# Altium project MAIN_BOARD.PrjPcb (part 2 of 3)

## Sheet USB.SchDoc
size D; SheetNumber: 4; SheetTotal: 8
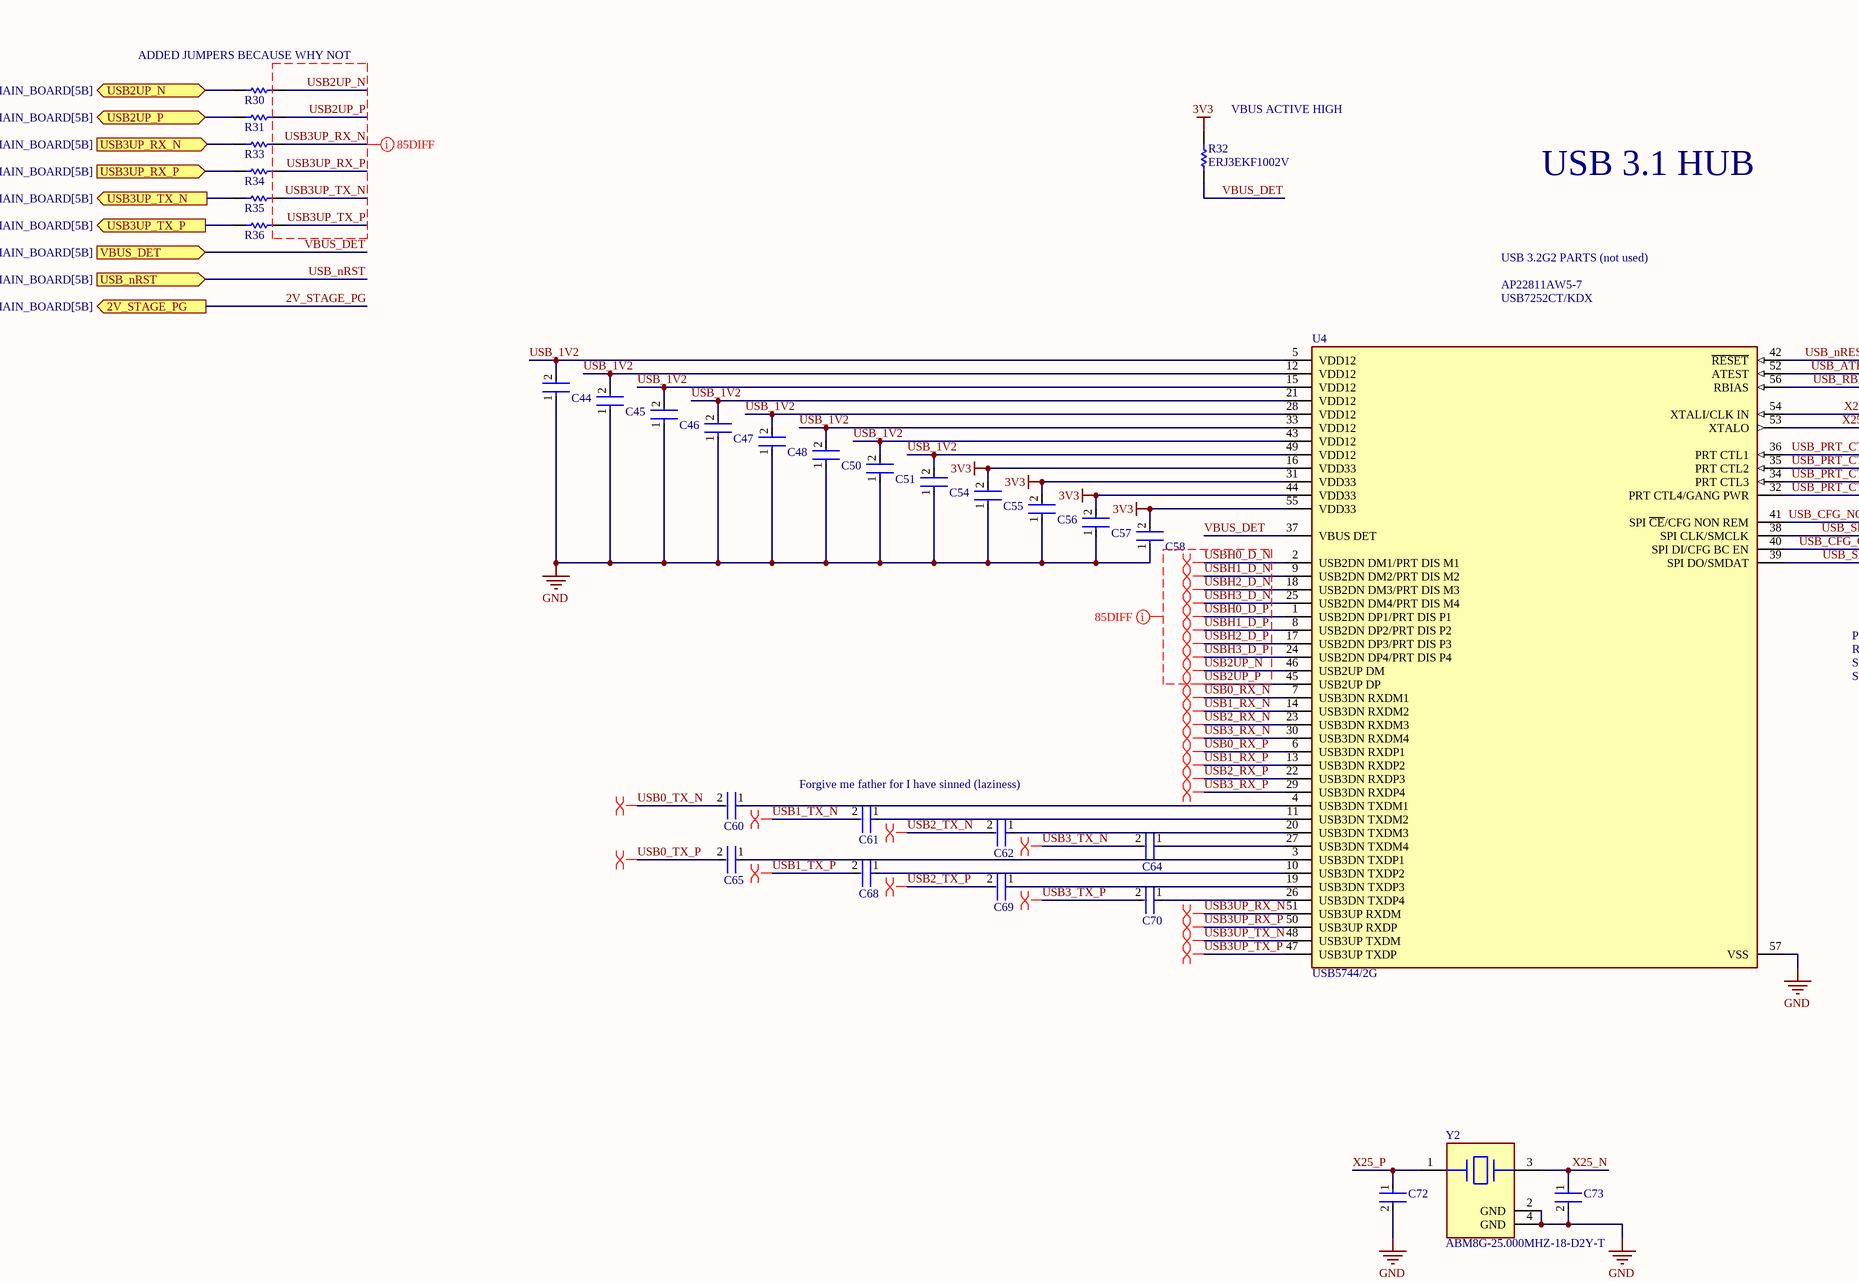
[diagram p10: USB.SchDoc, top left]
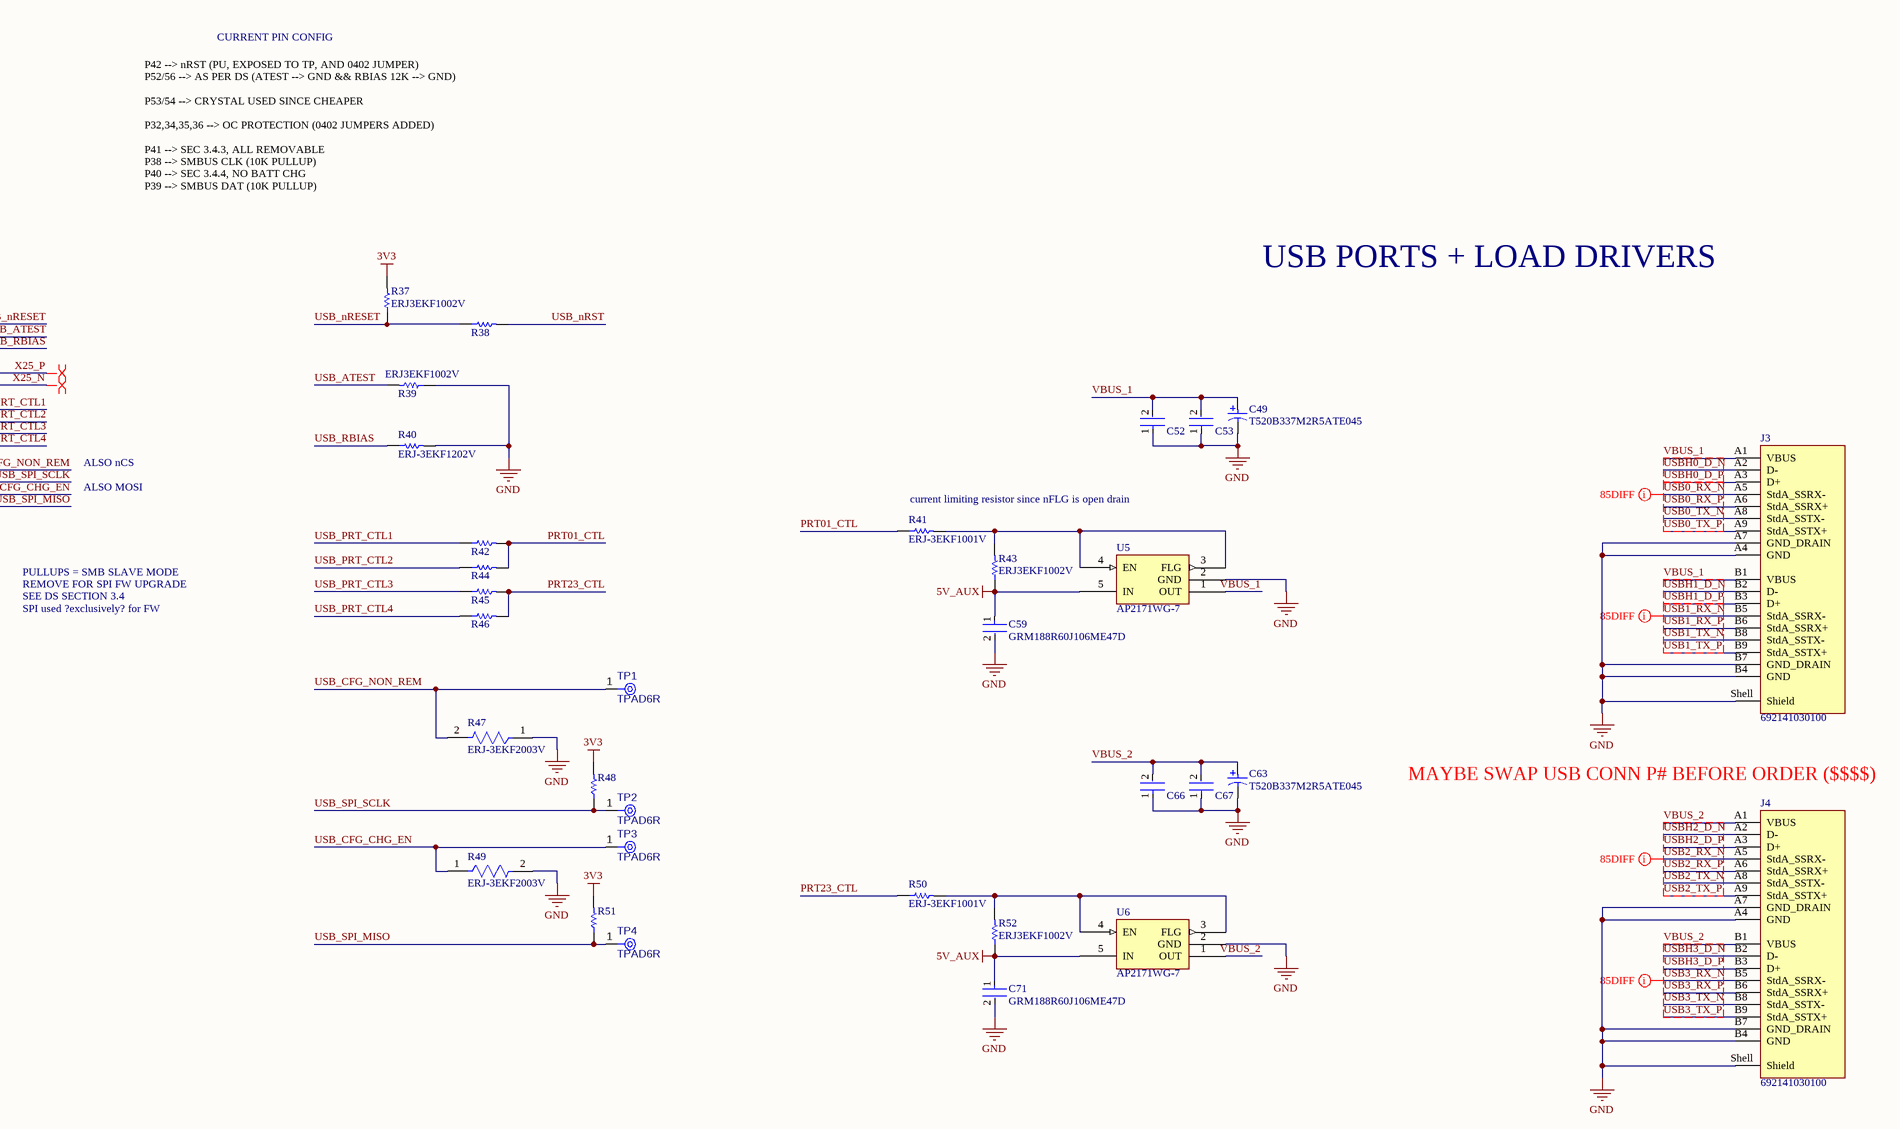
[diagram p11: USB.SchDoc, top right]
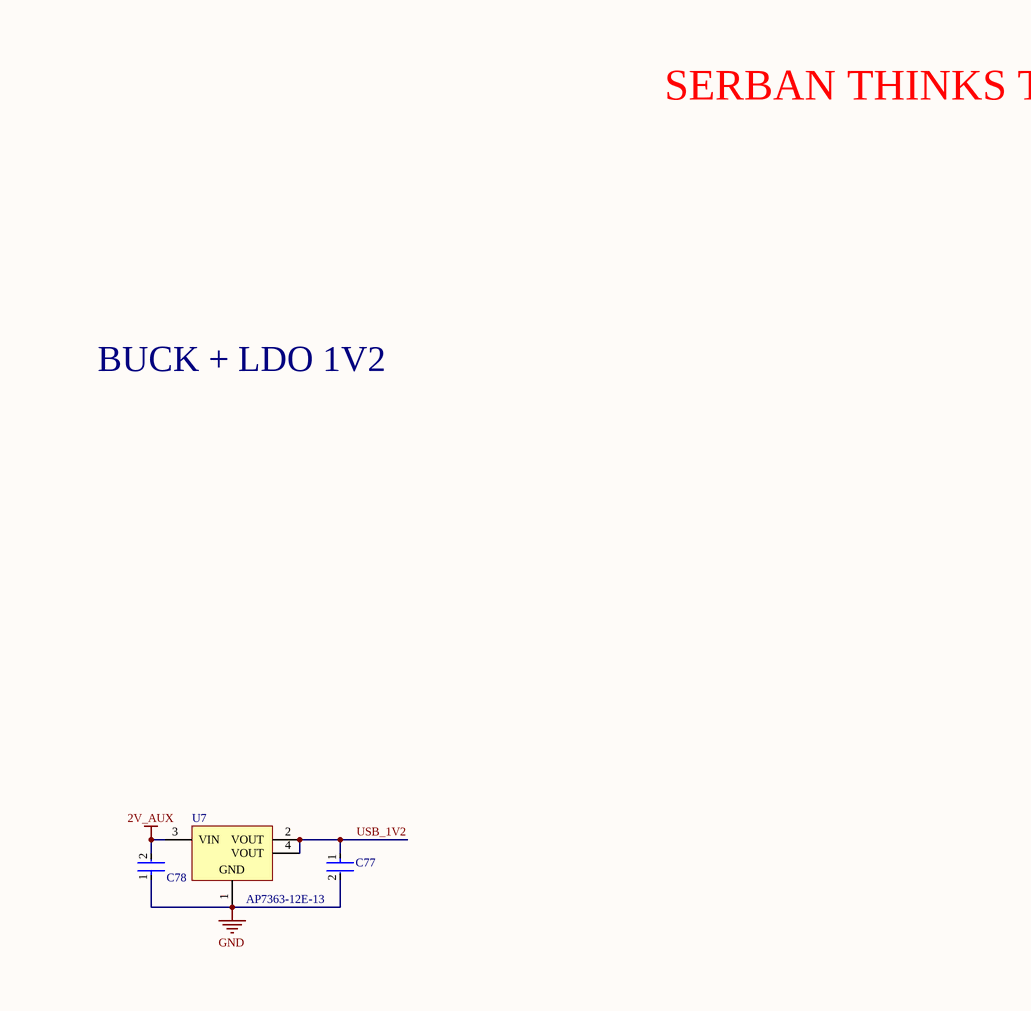
[diagram p12: USB.SchDoc, bottom left]
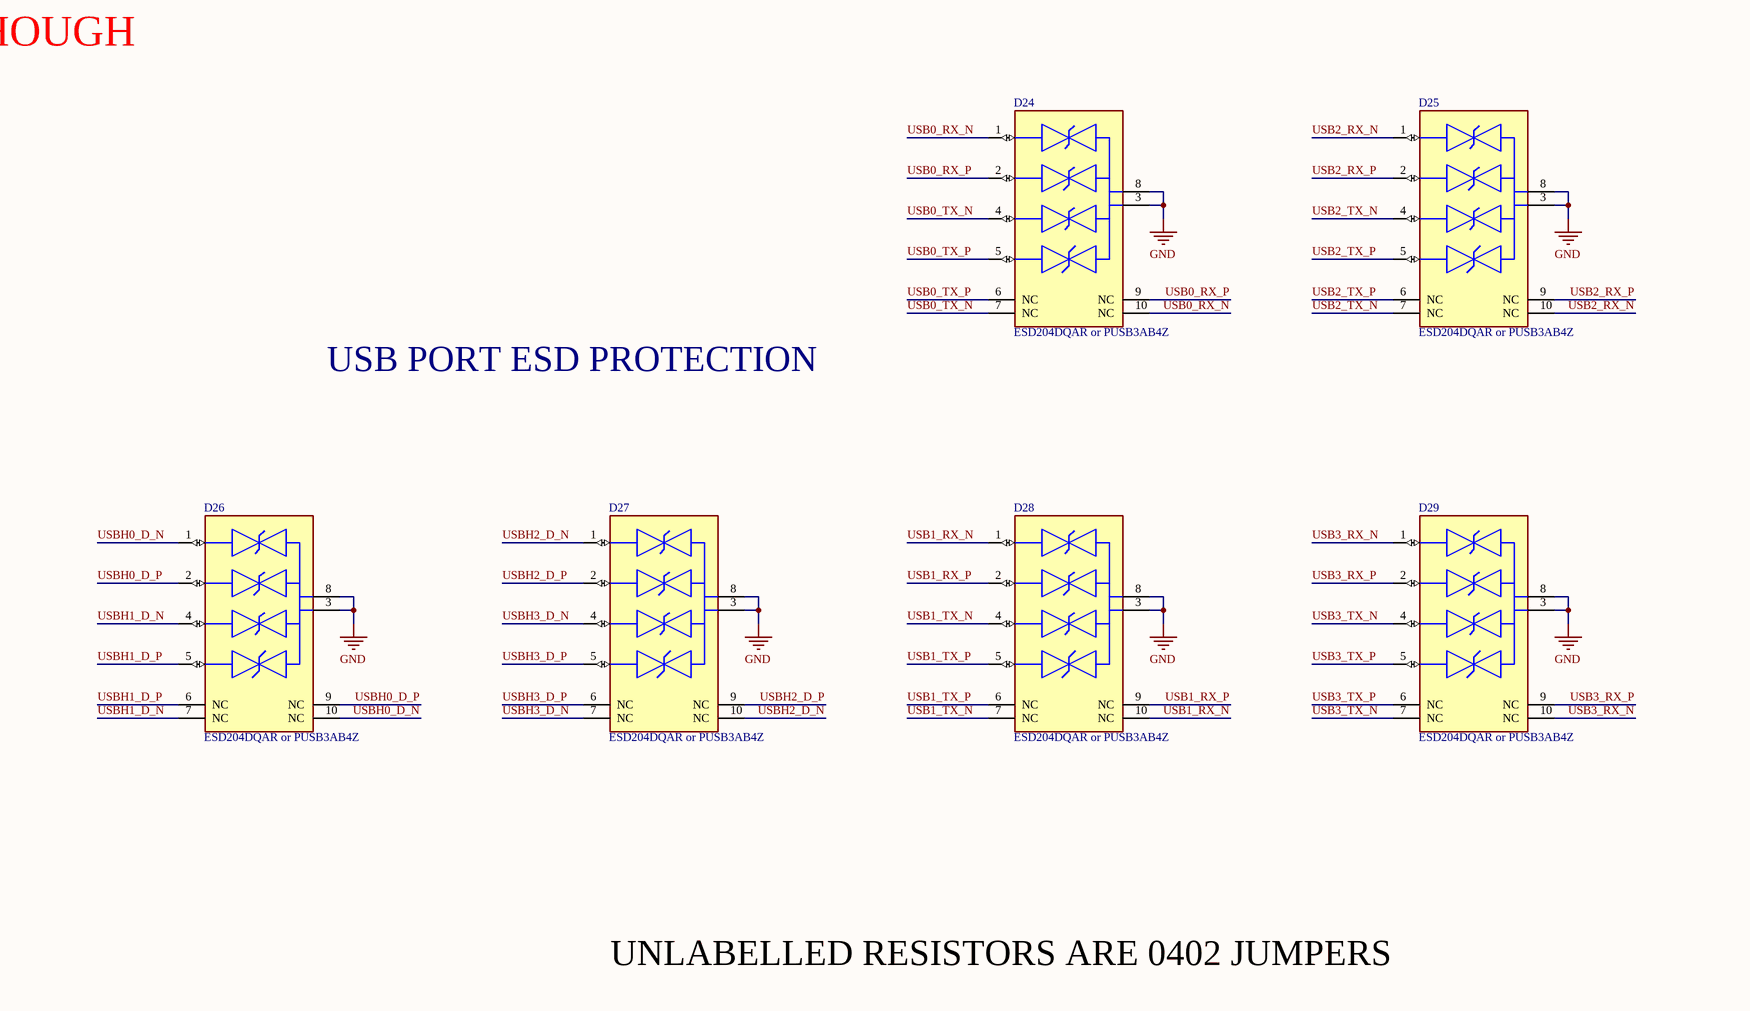
[diagram p13: USB.SchDoc, bottom right]

### Parts
C44  C1005X7R1H104K050BB  [FP-C1005-050-0_05-IPC_C]  (value not drawn)
C45  C1005X7R1H104K050BB  [FP-C1005-050-0_05-IPC_C]  (value not drawn)
C46  C1005X7R1H104K050BB  [FP-C1005-050-0_05-IPC_C]  (value not drawn)
C47  C1005X7R1H104K050BB  [FP-C1005-050-0_05-IPC_C]  (value not drawn)
C48  C1005X7R1H104K050BB  [FP-C1005-050-0_05-IPC_C]  (value not drawn)
C49  T520B337M2R5ATE045  [KEMT-520-B-2_M]
C50  C1005X7R1H104K050BB  [FP-C1005-050-0_05-IPC_C]  (value not drawn)
C51  C1005X7R1H104K050BB  [FP-C1005-050-0_05-IPC_C]  (value not drawn)
C52  C1005X7R1H104K050BB  [FP-C1005-050-0_05-IPC_C]  (value not drawn)
C53  C1005X7R1H104K050BB  [FP-C1005-050-0_05-IPC_C]  (value not drawn)
C54  C1005X7R1H104K050BB  [FP-C1005-050-0_05-IPC_C]  (value not drawn)
C55  C1005X7R1H104K050BB  [FP-C1005-050-0_05-IPC_C]  (value not drawn)
C56  C1005X7R1H104K050BB  [FP-C1005-050-0_05-IPC_C]  (value not drawn)
C57  C1005X7R1H104K050BB  [FP-C1005-050-0_05-IPC_C]  (value not drawn)
C58  C1005X7R1H104K050BB  [FP-C1005-050-0_05-IPC_C]  (value not drawn)
C59  GRM188R60J106ME47D  [FP-GRM188-0_1-e0_2_0_55-IPC_A]
C60  C1005X7R1H104K050BB  [FP-C1005-050-0_05-IPC_C]  (value not drawn)
C61  C1005X7R1H104K050BB  [FP-C1005-050-0_05-IPC_C]  (value not drawn)
C62  C1005X7R1H104K050BB  [FP-C1005-050-0_05-IPC_C]  (value not drawn)
C63  T520B337M2R5ATE045  [KEMT-520-B-2_M]
C64  C1005X7R1H104K050BB  [FP-C1005-050-0_05-IPC_C]  (value not drawn)
C65  C1005X7R1H104K050BB  [FP-C1005-050-0_05-IPC_C]  (value not drawn)
C66  C1005X7R1H104K050BB  [FP-C1005-050-0_05-IPC_C]  (value not drawn)
C67  C1005X7R1H104K050BB  [FP-C1005-050-0_05-IPC_C]  (value not drawn)
C68  C1005X7R1H104K050BB  [FP-C1005-050-0_05-IPC_C]  (value not drawn)
C69  C1005X7R1H104K050BB  [FP-C1005-050-0_05-IPC_C]  (value not drawn)
C70  C1005X7R1H104K050BB  [FP-C1005-050-0_05-IPC_C]  (value not drawn)
C71  GRM188R60J106ME47D  [FP-GRM188-0_1-e0_2_0_55-IPC_A]
C72  C0603C300J5GACTU  [FP-C0603C-CF-MFG]  (value not drawn)
C73  C0603C300J5GACTU  [FP-C0603C-CF-MFG]  (value not drawn)
C77  GRM188R60J106ME47D  [FP-GRM188-0_1-e0_2_0_55-IPC_A]  (value not drawn)
C78  C1005X7R1H104K050BB  [FP-C1005-050-0_05-IPC_C]  (value not drawn)
D24  ESD204DQAR or PUSB3AB4Z  [FP-DQA0010A-MFG]
D25  ESD204DQAR or PUSB3AB4Z  [FP-DQA0010A-MFG]
D26  ESD204DQAR or PUSB3AB4Z  [FP-DQA0010A-MFG]
D27  ESD204DQAR or PUSB3AB4Z  [FP-DQA0010A-MFG]
D28  ESD204DQAR or PUSB3AB4Z  [FP-DQA0010A-MFG]
D29  ESD204DQAR or PUSB3AB4Z  [FP-DQA0010A-MFG]
J3  692141030100  [692141030100]
J4  692141030100  [692141030100]
R30  0402 JUMPER 0 OHM  [RESC1005X40X25NL05T05]  (value not drawn)
R31  0402 JUMPER 0 OHM  [RESC1005X40X25NL05T05]  (value not drawn)
R32  ERJ3EKF1002V  [RESC1609X55X30LL15T15]
R33  0402 JUMPER 0 OHM  [RESC1005X40X25NL05T05]  (value not drawn)
R34  0402 JUMPER 0 OHM  [RESC1005X40X25NL05T05]  (value not drawn)
R35  0402 JUMPER 0 OHM  [RESC1005X40X25NL05T05]  (value not drawn)
R36  0402 JUMPER 0 OHM  [RESC1005X40X25NL05T05]  (value not drawn)
R37  ERJ3EKF1002V  [RESC1609X55X30LL15T15]
R38  0402 JUMPER 0 OHM  [RESC1005X40X25NL05T05]  (value not drawn)
R39  ERJ3EKF1002V  [RESC1609X55X30LL15T15]
R40  ERJ-3EKF1202V  [RESC1609X55X30ML15T15]
R41  ERJ-3EKF1001V  [RESC1608X55X30LL15T15]
R42  0402 JUMPER 0 OHM  [RESC1005X40X25NL05T05]  (value not drawn)
R43  ERJ3EKF1002V  [RESC1609X55X30LL15T15]
R44  0402 JUMPER 0 OHM  [RESC1005X40X25NL05T05]  (value not drawn)
R45  0402 JUMPER 0 OHM  [RESC1005X40X25NL05T05]  (value not drawn)
R46  0402 JUMPER 0 OHM  [RESC1005X40X25NL05T05]  (value not drawn)
R47  ERJ-3EKF2003V  [FP-ERJ3EK-IPC_B]
R48  ERJ3EKF1002V  [RESC1609X55X30LL15T15]  (value not drawn)
R49  ERJ-3EKF2003V  [FP-ERJ3EK-IPC_B]
R50  ERJ-3EKF1001V  [RESC1608X55X30LL15T15]
R51  ERJ3EKF1002V  [RESC1609X55X30LL15T15]  (value not drawn)
R52  ERJ3EKF1002V  [RESC1609X55X30LL15T15]
TP1  TPAD6R  [TP06R]  (no BOM)
TP2  TPAD6R  [TP06R]  (no BOM)
TP3  TPAD6R  [TP06R]  (no BOM)
TP4  TPAD6R  [TP06R]  (no BOM)
U4  USB5744/2G  [FP-USB5744-2G-MFG]
U5  AP2171WG-7  [SOT95P285X130-5N]
U6  AP2171WG-7  [SOT95P285X130-5N]
U7  AP7363-12E-13  [SOT-223_M]
Y2  ABM8G-25.000MHZ-18-D2Y-T  [FP-ABM8G-MFG]

### Ports
2V_STAGE_PG (out, see MAIN_BOARD[5B]), USB2UP_N (bidir, see MAIN_BOARD[5B]), USB2UP_P (bidir, see MAIN_BOARD[5B]), USB3UP_RX_N (in, see MAIN_BOARD[5B]), USB3UP_RX_P (in, see MAIN_BOARD[5B]), USB3UP_TX_N (out, see MAIN_BOARD[5B]), USB3UP_TX_P (out, see MAIN_BOARD[5B]), USB_nRST (in, see MAIN_BOARD[5B]), VBUS_DET (in, see MAIN_BOARD[5B])

### Nets
2V_AUX: C78.2 U7.3(VIN)
3V3: C55.2 C56.2 C57.2 C58.2 R32.2 R37.2 R48.2 R51.2 U4.16(VDD33) U4.31(VDD33) U4.44(VDD33) U4.55(VDD33)
5V_AUX: C59.1 C71.1 R43.1 R52.1 U5.5(IN) U6.5(IN)
GND: C44.1 C45.1 C46.1 C47.1 C48.1 C49.2 C50.1 C51.1 C52.1 C53.1 C54.1 C55.1 C56.1 C57.1 C58.1 C59.2 C63.2 C66.1 C67.1 C71.2 C72.2 C73.2 C77.2 C78.1 D24.3(GND) D24.8(GND) D25.3(GND) D25.8(GND) D26.3(GND) D26.8(GND) D27.3(GND) D27.8(GND) D28.3(GND) D28.8(GND) D29.3(GND) D29.8(GND) J3.A4(GND) J3.A7(GND_DRAIN) J3.B4(GND) J3.B7(GND_DRAIN) J3.Shell(Shield) J4.A4(GND) J4.A7(GND_DRAIN) J4.B4(GND) J4.B7(GND_DRAIN) J4.Shell(Shield) R39.1 R40.2 R47.1 R49.2 U4.57(VSS) U5.2(GND) U6.2(GND) U7.1(GND) Y2.2(GND) Y2.4(GND)
2V_STAGE_PG: port 2V_STAGE_PG
PRT01_CTL: R41.1 R42.2 R44.2
PRT23_CTL: R45.2 R46.2 R50.1
USB0_RX_N: D24.1(IO1) D24.10(NC) J3.A5(StdA_SSRX-) U4.7(USB3DN_RXDM1)
USB0_RX_P: D24.2(IO2) D24.9(NC) J3.A6(StdA_SSRX+) U4.6(USB3DN_RXDP1)
USB0_TX_N: C60.2 D24.4(IO3) D24.7(NC) J3.A8(StdA_SSTX-)
USB0_TX_P: C65.2 D24.5(IO4) D24.6(NC) J3.A9(StdA_SSTX+)
USB1_D_N: R30.1 ; port USB2UP_N
USB1_D_P: R31.1 ; port USB2UP_P
USB1_RX_N: D28.1(IO1) D28.10(NC) J3.B5(StdA_SSRX-) U4.14(USB3DN_RXDM2)
USB1_RX_P: D28.2(IO2) D28.9(NC) J3.B6(StdA_SSRX+) U4.13(USB3DN_RXDP2)
USB1_TX_N: C61.2 D28.4(IO3) D28.7(NC) J3.B8(StdA_SSTX-)
USB1_TX_P: C68.2 D28.5(IO4) D28.6(NC) J3.B9(StdA_SSTX+)
USB2_RX_N: D25.1(IO1) D25.10(NC) J4.A5(StdA_SSRX-) U4.23(USB3DN_RXDM3)
USB2_RX_P: D25.2(IO2) D25.9(NC) J4.A6(StdA_SSRX+) U4.22(USB3DN_RXDP3)
USB2_TX_N: C62.2 D25.4(IO3) D25.7(NC) J4.A8(StdA_SSTX-)
USB2_TX_P: C69.2 D25.5(IO4) D25.6(NC) J4.A9(StdA_SSTX+)
USB2UP_N: R30.2 U4.46(USB2UP_DM)
USB2UP_P: R31.2 U4.45(USB2UP_DP)
USB3_RX_N: D29.1(IO1) D29.10(NC) J4.B5(StdA_SSRX-) U4.30(USB3DN_RXDM4)
USB3_RX_P: D29.2(IO2) D29.9(NC) J4.B6(StdA_SSRX+) U4.29(USB3DN_RXDP4)
USB3_TX_N: C64.2 D29.4(IO3) D29.7(NC) J4.B8(StdA_SSTX-)
USB3_TX_P: C70.2 D29.5(IO4) D29.6(NC) J4.B9(StdA_SSTX+)
USB3UP_RX_N: R33.2 U4.51(USB3UP_RXDM)
USB3UP_RX_P: R34.2 U4.50(USB3UP_RXDP)
USB3UP_TX_N: R35.2 U4.48(USB3UP_TXDM)
USB3UP_TX_P: R36.2 U4.47(USB3UP_TXDP)
USB_1V2: C44.2 C45.2 C46.2 C47.2 C48.2 C50.2 C51.2 C54.2 C77.1 U4.5(VDD12) U4.12(VDD12) U4.15(VDD12) U4.21(VDD12) U4.28(VDD12) U4.33(VDD12) U4.43(VDD12) U4.49(VDD12) U7.2(VOUT) U7.4(VOUT)
USB_ATEST: R39.2 U4.52(ATEST)
USB_CFG_CHG_EN: R49.1 TP3.1(TP) U4.40(SPI_DI/CFG_BC_EN)
USB_CFG_NON_REM: R47.2 TP1.1(TP) U4.41(SPI_~{CE}/CFG_NON_REM)
USB_nRESET: R37.1 R38.1 U4.42(~{RESET})
USB_nRST: R38.2 ; port USB_nRST
USB_PRT_CTL1: R42.1 U4.36(PRT_CTL1)
USB_PRT_CTL2: R44.1 U4.35(PRT_CTL2)
USB_PRT_CTL3: R45.1 U4.34(PRT_CTL3)
USB_PRT_CTL4: R46.1 U4.32(PRT_CTL4/GANG_PWR)
USB_RBIAS: R40.1 U4.56(RBIAS)
USB_SPI_MISO: R51.1 TP4.1(TP) U4.39(SPI_DO/SMDAT)
USB_SPI_SCLK: R48.1 TP2.1(TP) U4.38(SPI_CLK/SMCLK)
USBH0_D_N: D26.1(IO1) D26.10(NC) J3.A2(D-) U4.2(USB2DN_DM1/PRT_DIS_M1)
USBH0_D_P: D26.2(IO2) D26.9(NC) J3.A3(D+) U4.1(USB2DN_DP1/PRT_DIS_P1)
USBH1_D_N: D26.4(IO3) D26.7(NC) J3.B2(D-) U4.9(USB2DN_DM2/PRT_DIS_M2)
USBH1_D_P: D26.5(IO4) D26.6(NC) J3.B3(D+) U4.8(USB2DN_DP2/PRT_DIS_P2)
USBH2_D_N: D27.1(IO1) D27.10(NC) J4.A2(D-) U4.18(USB2DN_DM3/PRT_DIS_M3)
USBH2_D_P: D27.2(IO2) D27.9(NC) J4.A3(D+) U4.17(USB2DN_DP3/PRT_DIS_P3)
USBH3_D_N: D27.4(IO3) D27.7(NC) J4.B2(D-) U4.25(USB2DN_DM4/PRT_DIS_M4)
USBH3_D_P: D27.5(IO4) D27.6(NC) J4.B3(D+) U4.24(USB2DN_DP4/PRT_DIS_P4)
USBSS0_RX_N: R33.1 ; port USB3UP_RX_N
USBSS0_RX_P: R34.1 ; port USB3UP_RX_P
USBSS0_TX_N: R35.1 ; port USB3UP_TX_N
USBSS0_TX_P: R36.1 ; port USB3UP_TX_P
VBUS_1: C49.1 C52.2 C53.2 J3.A1(VBUS) J3.B1(VBUS) U5.1(OUT)
VBUS_2: C63.1 C66.2 C67.2 J4.A1(VBUS) J4.B1(VBUS) U6.1(OUT)
VBUS_DET: R32.1 U4.37(VBUS_DET) ; port VBUS_DET
X25_N: C73.1 U4.53(XTALO) Y2.3
X25_P: C72.1 U4.54(XTALI/CLK_IN) Y2.1
NetC60_1: C60.1 U4.4(USB3DN_TXDM1)
NetC61_1: C61.1 U4.11(USB3DN_TXDM2)
NetC62_1: C62.1 U4.20(USB3DN_TXDM3)
NetC64_1: C64.1 U4.27(USB3DN_TXDM4)
NetC65_1: C65.1 U4.3(USB3DN_TXDP1)
NetC68_1: C68.1 U4.10(USB3DN_TXDP2)
NetC69_1: C69.1 U4.19(USB3DN_TXDP3)
NetC70_1: C70.1 U4.26(USB3DN_TXDP4)
NetR41_2: R41.2 R43.2 U5.3(FLG) U5.4(EN)
NetR50_2: R50.2 R52.2 U6.3(FLG) U6.4(EN)

### Layout directives
differential pair: USB0_RX_N, USB0_RX_P, USB0_TX_N, USB0_TX_P, USB1_RX_N, USB1_RX_P, USB1_TX_N, USB1_TX_P, USB2_RX_N, USB2_RX_P, USB2_TX_N, USB2_TX_P, USB2UP_N, USB2UP_P, USB3_RX_N, USB3_RX_P, USB3_TX_N, USB3_TX_P, USB3UP_RX_N, USB3UP_RX_P, USB3UP_TX_N, USB3UP_TX_P, USBH0_D_N, USBH0_D_P, USBH1_D_N, USBH1_D_P, USBH2_D_N, USBH2_D_P, USBH3_D_N, USBH3_D_P, X25_N, X25_P
net class 85DIFF: USB0_RX_N, USB1_RX_N, USB2_RX_N, USB2UP_N, USB2UP_P, USB3_RX_N, USB3UP_RX_N, USBH0_D_N, USBH0_D_P, USBH1_D_N, USBH1_D_P, USBH2_D_N, USBH2_D_P, USBH3_D_N, USBH3_D_P

### Notes on the sheet
- CURRENT PIN CONFIG
- (near R30) ADDED JUMPERS BECAUSE WHY NOT
- (near R32) VBUS ACTIVE HIGH
- USB 3.1 HUB
- P42 --> nRST (PU, EXPOSED TO TP, AND 0402 JUMPER)
  P52/56 --> AS PER DS (ATEST --> GND && RBIAS 12K --> GND)
  P53/54 --> CRYSTAL USED SINCE CHEAPER
  P32,34,35,36 --> OC PROTECTION (0402 JUMPERS ADDED)
  P41 --> SEC 3.4.3, ALL REMOVABLE
  P38 --> SMBUS CLK (10K PULLUP)
  P40 --> SEC 3.4.4, NO BATT CHG
  P39 --> SMBUS DAT (10K PULLUP)
- AP22811AW5-7
- USB7252CT/KDX
- USB 3.2G2 PARTS (not used)
- USB PORTS + LOAD DRIVERS
- ALSO nCS
- ALSO MOSI
- (near R41) current limiting resistor since nFLG is open drain
- PULLUPS = SMB SLAVE MODE
- REMOVE FOR SPI FW UPGRADE
- SPI used ?exclusively? for FW
- SEE DS SECTION 3.4
- Forgive me father for I have sinned (laziness)
- (near J4) MAYBE SWAP USB CONN P# BEFORE ORDER ($$$$)
- SERBAN THINKS THIS IS OK, MAY FIND MISTAKES WHILE ROUTING THOUGH
- BUCK + LDO 1V2
- USB PORT ESD PROTECTION
- UNLABELLED RESISTORS ARE 0402 JUMPERS

### Library data of the parts
C44-C48 C50-C58 C60-C62 C64-C70 C78 = CMP-2000-05393-2: Multilayer Ceramic Capacitors 100nF ±10% 50V X7R SMD 0402; Voltage: 50V; Dielectric Material: Ceramic; Min Operating Temperature: -55°C; Depth: 0.5mm; Radiation Hardening: No; RoHS Compliant: Yes; Voltage Rating (DC): 50V; Lead Free: Lead Free; Resistor Type: Ceramic; Height: 0.5mm; Dielectric: X7R; Thickness: 0.022inch; Case/Package: 0402; Case Code (Metric): 1005; Termination: SMD/SMT; Capacitance: 100nF; Packaging: Tape and Reel; Max Operating Temperature: 125°C; Mount: Surface Mount; Package Quantity: 1; Width: 0.02inch; Weight: 2.3E-05oz; Voltage Rating: 50V; Tolerance: 10%; Construction: Flat; Case Code (Imperial): 0402; Length: 1mm; REACH SVHC: No SVHC; Series: C
C49 C63 = CMP-1664-00002-2: Tantalum Capacitor, 330 uF, +/- 20%, 2.5 V, -55 to 105 degC, 2-Pin Molded, RoHS, Tape and Reel; Capacitance: 330 uF; PartNumber: T520B337M2R5ATE045; DatasheetVersion: 07/2016; Radiation Hardening: No; ComponentLink2Description: Datasheet; PackageDescription: 2-Pin Surface Mount Device, Body 3.5 x 2.8 mm; Width: 2.8 mm; ComponentLink2URL: http://capacitoredge.kemet.com/capedge2/DataSheet?pn=T520B337M2R5ATE045; Case/Package: 1411; Length: 3.5 mm; Package Quantity: 2000; Max Operating Temperature: 105 degC; Mounting Technology: Surface Mount; Height: 2.1 mm; RoHSCompliant: True; ComponentLink1URL: http://www.kemet.com/; Mount: Surface Mount; Packaging: Tape and Reel; ComponentLink1Description: Manufacturer URL; Min Operating Temperature: -55 degC
C59 C71 C77 = CMP-2006-02792-2: Chip Multilayer Ceramic Capacitors for General Purpose, 0603, 10uF, X5R, 15%, 20%, 6.3V; Packaging: Tape and Reel; Voltage Rating (DC): 6.3V; Width: 0.031inch; Termination: SMD/SMT; Dielectric: X5R; Package Quantity: 4000; Voltage Rating: 6.3V; Capacitance: 10uF; Case/Package: 0603; Min Operating Temperature: -55°C; Voltage: 6.3V; Length: 1.6mm; Thickness: 0.035inch; Lead Free: Lead Free; Depth: 0.8mm; Case Code (Imperial): 0603; Max Operating Temperature: 85°C; Material: Ceramic; Height: 0.8mm; Tolerance: 20%; Mount: Surface Mount; REACH SVHC: No SVHC; Radiation Hardening: No; Case Code (Metric): 1608
C72 C73 = CMP-1035-00914-3: CAP CER 30PF 50V 5% NP0 0603; Manufacturer: KEMET; Automotive Grade: Grade 1; Temperature Coefficient: 30ppm/°C; Material: Ceramic; Temperature Characteristic: C0G; Tolerance: 0.05; Manufacturer Part Number: C0603C300J5GACTU; ComponentLink2URL: https://api.kemet.com/component-edge/download/datasheet/C0603C100J5GACAUTO.pdf; Automotive: Yes; Device Class L2: Capacitors; Device Class L1: Passive Components; Device Class L3: Ceramic Capacitors; RoHS: TRUE; Octopart: https://octopart.com/c0603c300j5gactu-kemet-199455; Lead Free: Yes; Value: 30 pF; Temperature Range High: +125°C; Category: Cap; Temperature: -55°C to +125°C; Package: C0603C-CF; Capacitance: 30 pF; Digikey Description: CAP CER 30PF 50V 5% NP0 0603; Height: 0.87mm; ComponentLink2Description: Datasheet; Temperature Range Low: -55°C; Mouser Description: Multilayer Ceramic Capacitors MLCC - SMD/SMT 50volts 30pF C0G 5%; Voltage Rating: 50 V
D24-D29 = CMP-04989-000002-1: as D1 on sheet JETSON; Ambient Temperature Range High: +125°C; ComponentLink2Description: Datasheet; Height: 0.55mm; Lead Free: Yes; Device Class L3: unset; Temperature Range High: +125°C; Temperature Range Low: -40°C; Package: DQA0010A; Temperature: -40°C to +125°C; Capacitance: 0.55pF; RoHS: TRUE; Mouser Description: 4-Channel Low-Capacitance Surge and ESD Protection Diode 10-USON -40 to 125; Category: Diode; Device Class L1: Circuit Protection; Octopart: https://octopart.com/esd204dqar-texas+instruments-89917476; Device Class L2: TVS Diodes; Ambient Temperature Range Low: -40°C; Manufacturer Part Number: ESD204DQAR; ComponentLink2URL: http://www.ti.com/lit/ds/symlink/esd204.pdf; Automotive: No; Digikey Description: 4-CHANNEL LOW-CAPACITANCE SURGE
J3 J4 = CMP-1502-03222-3: NexarPartId: 19667819; Connector Type: USB; Contact Resistance: 50mΩ; USB Standard: USB 3.0; Insulation Resistance: 100MΩ; Number of Contacts: 18; Gender: Receptacle; Number of Ports: 2; Voltage Rating (AC): 30V; Current Rating: 1.8A; Min Operating Temperature: -40°C; Max Operating Temperature: 85°C; Lead Free: Lead Free; Features: Shielded; Width: 19.7mm; Length: 15.59mm; Flammability Rating: UL94 V-0; Contact Plating: Gold; RoHS: Compliant; Number of Pins: 18; Termination: Through Hole; Contact Material: Bronze, Gold, Nickel; Mount: Horizontal, Through Hole; Voltage Rating: 30V; Operating Supply Voltage: 30V; REACH SVHC: Unknown; Orientation: Right Angle; Color: Blue; Height: 16.335mm
R30 R31 R33-R36 R38 R42 R44-R46 = CMP-009-00206-2: READ THE NAME
R32 R37 R39 R43 R48 R51 R52 = CMP-1012-00623-3: as R22 on sheet JETSON; Number of Pins: 2; Package Reference: 603; Depth: 0.8mm; Mount: SurfaceMount; Package Description: 2-Pin Surface Mount Device, Body 1.6 x 0.85 mm; Datasheet Version: 02/2017; Length: 1.6mm; Lead Free: LeadFree; Height: 0.45mm; Number of Terminations: 2; Max Power Dissipation: 100mW; Min Operating Temperature: -55degC; Datasheet URL: https://industrial.panasonic.com/cdbs/www-data/pdf/RDA0000/AOA0000C304.pdf; Termination: SMD/SMT; Case Code (Metric): 1608; Case Code (Imperial): 0603; Tolerance: 1%; Max Operating Temperature: 155degC; RoHSCompliant: true; Voltage Rating (DC): 75V; Radiation Hardening: No; Packaging: TapeandReel; Composition: ThickFilm; Mounting Technology: SurfaceMount; Manufacturer URL: http://www.panasonic.com/; Width: 0.031inch; REACH SVHC: NoSVHC; Contact Plating: Tin; Military Standard: Not; Package Quantity: 1
R40 = CMP-1012-00631-3: Chip Resistor, 12 KOhm, +/- 1%, 0.1 W, -55 to 155 degC, 0603 (1608 Metric), RoHS, Tape and Reel; Manufacturer: Panasonic; Power Rating: 100mW; Temperature Coefficient: 100ppm/degreesC; Voltage Rating (DC): 75V; Resistance: 12KOhm; REACH SVHC: NoSVHC; Composition: ThickFilm; Case/Package: 0603; RoHSCompliant: true; Package URL: http://www.st.com/st-web-ui/static/active/en/resource/technical/document/datasheet/CD00001320.pdf; Radiation Hardening: No; Height: 0.022inch; Termination: SMD/SMT; Number of Pins: 2; Package Description: 2-Pin Surface Mount Device, Body 1.6 x 0.85 mm; Datasheet URL: https://industrial.panasonic.com/cdbs/www-data/pdf/RDA0000/AOA0000C283.pdf; Width: 0.031inch; Length: 1.6mm; Datasheet Version: 42095.0; Manufacturer URL: http://www.panasonic.com/; Number of Terminations: 2; Case Code (Imperial): 0603; Depth: 0.8mm; Package Quantity: 1; Package Reference: 0603; Case Code (Metric): 1608; Lead Free: LeadFree; Military Standard: Not; Max Power Dissipation: 100mW; Min Operating Temperature: -55degC; Max Operating Temperature: 155degC; Contact Plating: Tin; Voltage Rating: 75V; Weight: 7.1E-05oz; Mount: SurfaceMount; Packaging: TapeandReel; Tolerance: 1%
R41 R50 = CMP-2000-00180-1: Manufacturer: Panasonic; Part Number: ERJ-3EKF1001V
R47 R49 = CMP-2000-00319-2: RES SMD 200K OHM 1% 1/10W 0603; Resistance: 200kR; Max Power Dissipation: 100mW; Working Voltage: 75V; Voltage Rating (DC): 50V; Temperature Coefficient: 100ppm/°C; Min Operating Temperature: -55°C; Resistor Type: Thick Film; Max Operating Temperature: 155°C; Packaging: Cut Tape; RoHS Compliant: Yes; Military Standard: Not; Termination: SMD/SMT; Tolerance: 1%; Case Code (Imperial): 0603; Depth: 0.8mm; Lead Free: Lead Free; Resistance Tolerance: 1%; Case Code (Metric): 1608; Mount: Surface Mount; Construction: Rectangular; REACH SVHC: No SVHC; Height: 0.022inch; Radiation Hardening: No; Package Quantity: 1; Voltage Rating: 75V; Contact Plating: Tin; Number of Terminations: 2; Length: 1.6mm; Series: ERJ; Technology: THICK FILM; Features: Automotive AEC-Q200; Case/Package: 0603; Power Rating: 100mW; Width: 0.031inch
TP1-TP4 = CMP-00028-00002-2: 0.6mm round; Pins: 1
U4 = CMP-06284-000017-1: IC HUB CTLR USB 56VQFN; Min Operating Temperature: 0°C; Packaging: Tray; Lead Free: Lead Free; Interface: USB; Max Operating Temperature: 70°C
U5 U6 = CMP-019-00057-1: IC PWR SW USB 1CH 1A SOT-25-5
U7 = CMP-0244-00318-1: Fixed Low Drop Positive Voltage Regulator, 1.2V (pn is for 1.5A LDO), 4-Pin SOT-223, Tape and Reel; PackageDescription: 4-Pin SOT-223 Package, 6.5 x 3.5 mm Body, 2.3 mm Pitch, 7 mm Lead Span; PackageVersion: 2010; ComponentLink2Description: Datasheet; PackageReference: SOT-223; ComponentLink2URL: http://www.st.com/internet/com/TECHNICAL_RESOURCES/TECHNICAL_LITERATURE/DATASHEET/CD00000544.pdf; ComponentLink1Description: Manufacturer URL; DatasheetVersion: 1/11/2011; ComponentLink1URL: http://www.st.com
Y2 = CMP-2000-05733-3: Crystal 25MHz ±20ppm (Tol) ±30ppm (Stability) 18pF FUND 60Ω 4-Pin SMD T/R; Series Resistance: 60R; Length: 3.2mm; Depth: 2.5mm; Packaging: Tape and Reel; Min Operating Temperature: -40°C; Operating Frequency: 25 MHz; Lead Free: Lead Free; Number of Pins: 4; Frequency Tolerance: 20ppm; Radiation Hardening: No; Max Operating Temperature: 85°C; Termination: SMD/SMT; Frequency Stability: 30ppm; Frequency: 25MHz; Series: ABM8G; Mount: Surface Mount; Package Quantity: 1000; Height: 0.039inch; Width: 0.098inch; Case/Package: CSMD; ESR (Equivalent Series Resistance): 60R; Load Capacitance: 18pF; Tolerance: 20ppm

## Sheet ETHERNET.SchDoc
size A4; SheetNumber: 5; SheetTotal: 8
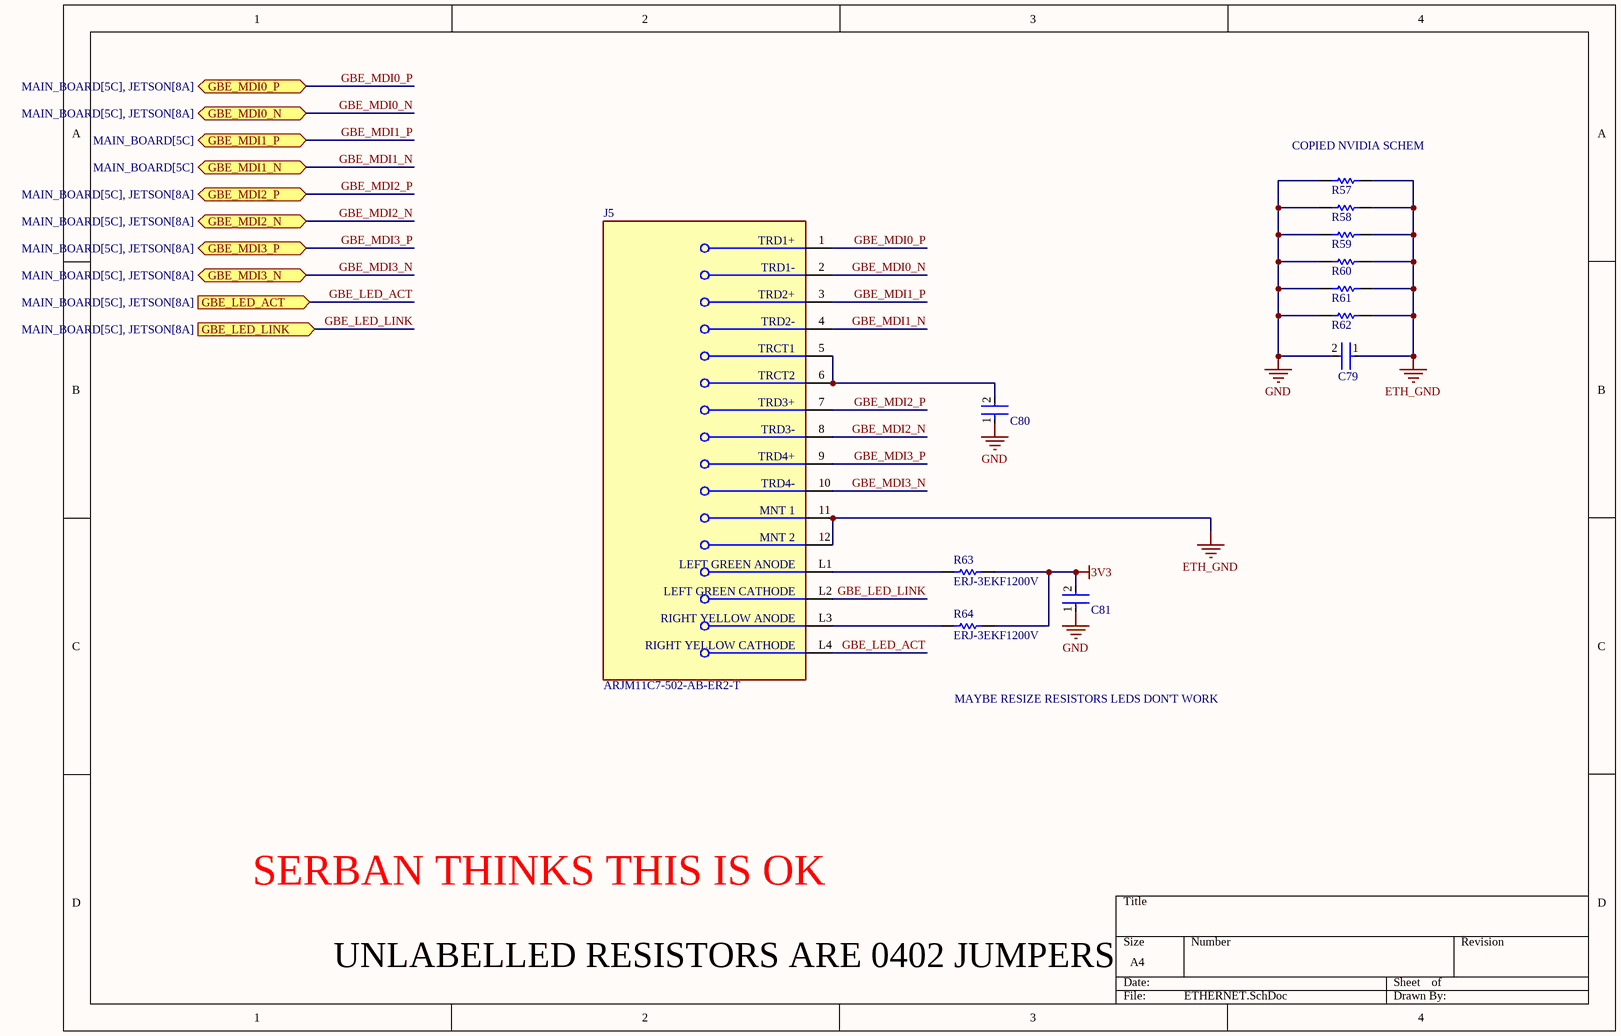
[diagram p14: ETHERNET.SchDoc]

### Parts
C79  C1005X7R1H104K050BB  [FP-C1005-050-0_05-IPC_C]  (value not drawn)
C80  C1005X7R1H104K050BB  [FP-C1005-050-0_05-IPC_C]  (value not drawn)
C81  C1005X7R1H104K050BB  [FP-C1005-050-0_05-IPC_C]  (value not drawn)
J5  ARJM11C7-502-AB-ER2-T  [FP-ARJM11C7-502-AB-ER2-T-MFG]
R57  0402 JUMPER 0 OHM  [RESC1005X40X25NL05T05]  (value not drawn)
R58  0402 JUMPER 0 OHM  [RESC1005X40X25NL05T05]  (value not drawn)
R59  0402 JUMPER 0 OHM  [RESC1005X40X25NL05T05]  (value not drawn)
R60  0402 JUMPER 0 OHM  [RESC1005X40X25NL05T05]  (value not drawn)
R61  0402 JUMPER 0 OHM  [RESC1005X40X25NL05T05]  (value not drawn)
R62  0402 JUMPER 0 OHM  [RESC1005X40X25NL05T05]  (value not drawn)
R63  ERJ-3EKF1200V  [RESC1609X55X30ML15T15]
R64  ERJ-3EKF1200V  [RESC1609X55X30ML15T15]

### Ports
GBE_LED_ACT (in, see MAIN_BOARD[5C], JETSON[8A]), GBE_LED_LINK (in, see MAIN_BOARD[5C], JETSON[8A]), GBE_MDI0_N (bidir, see MAIN_BOARD[5C], JETSON[8A]), GBE_MDI0_P (bidir, see MAIN_BOARD[5C], JETSON[8A]), GBE_MDI1_N (bidir, see MAIN_BOARD[5C]), GBE_MDI1_P (bidir, see MAIN_BOARD[5C]), GBE_MDI2_N (bidir, see MAIN_BOARD[5C], JETSON[8A]), GBE_MDI2_P (bidir, see MAIN_BOARD[5C], JETSON[8A]), GBE_MDI3_N (bidir, see MAIN_BOARD[5C], JETSON[8A]), GBE_MDI3_P (bidir, see MAIN_BOARD[5C], JETSON[8A])

### Nets
3V3: C81.2 R63.2 R64.2
ETH_GND: C79.1 J5.11(MNT_1) J5.12(MNT_2) R57.2 R58.2 R59.2 R60.2 R61.2 R62.2
GND: C79.2 C80.1 C81.1 R57.1 R58.1 R59.1 R60.1 R61.1 R62.1
GBE_LED_ACT: J5.L4(RIGHT_YELLOW_CATHODE) ; port GBE_LED_ACT
GBE_LED_LINK: J5.L2(LEFT_GREEN_CATHODE) ; port GBE_LED_LINK
GBE_MDI0_N: J5.2(TRD1-) ; port GBE_MDI0_N
GBE_MDI0_P: J5.1(TRD1+) ; port GBE_MDI0_P
GBE_MDI1_N: J5.4(TRD2-) ; port GBE_MDI1_N
GBE_MDI1_P: J5.3(TRD2+) ; port GBE_MDI1_P
GBE_MDI2_N: J5.8(TRD3-) ; port GBE_MDI2_N
GBE_MDI2_P: J5.7(TRD3+) ; port GBE_MDI2_P
GBE_MDI3_N: J5.10(TRD4-) ; port GBE_MDI3_N
GBE_MDI3_P: J5.9(TRD4+) ; port GBE_MDI3_P
NetC80_2: C80.2 J5.5(TRCT1) J5.6(TRCT2)
NetJ5_L1: J5.L1(LEFT_GREEN_ANODE) R63.1
NetJ5_L3: J5.L3(RIGHT_YELLOW_ANODE) R64.1

### Notes on the sheet
- (near R57) COPIED NVIDIA SCHEM
- MAYBE RESIZE RESISTORS LEDS DON'T WORK
- SERBAN THINKS THIS IS OK
- UNLABELLED RESISTORS ARE 0402 JUMPERS

### Library data of the parts
C79-C81 = CMP-2000-05393-2: as C44 on sheet USB; Voltage: 50V; Dielectric Material: Ceramic; Min Operating Temperature: -55°C; Depth: 0.5mm; Radiation Hardening: No; RoHS Compliant: Yes; Voltage Rating (DC): 50V; Lead Free: Lead Free; Resistor Type: Ceramic; Height: 0.5mm; Dielectric: X7R; Thickness: 0.022inch; Case/Package: 0402; Case Code (Metric): 1005; Termination: SMD/SMT; Capacitance: 100nF; Packaging: Tape and Reel; Max Operating Temperature: 125°C; Mount: Surface Mount; Package Quantity: 1; Width: 0.02inch; Weight: 2.3E-05oz; Voltage Rating: 50V; Tolerance: 10%; Construction: Flat; Case Code (Imperial): 0402; Length: 1mm; REACH SVHC: No SVHC; Series: C
J5 = CMP-27893-000001-1: RJ45 JACK W/MAG 1X1 1000BASE-T; Manufacturer: Abracon; Conn Gender: Female; Is Female: yes; Shielding: true; Pitch: 1.27mm; Number Of Contacts: 10; Conn Orientation: Right Angle; RoHS: TRUE; Digikey Description: RJ45 JACK W/MAG 1X1 1000BASE-T; Temperature Range Low: -40°C; ComponentLink2Description: Datasheet; Category: Conn; Temperature Range High: +85°C; Package: 0; Device Class L1: Connectors; Manufacturer Part Number: ARJM11C7-502-AB-ER2-T; ComponentLink2URL: https://abracon.com/Magnetics/ARJM11.pdf; Automotive: No; Contact Material: Gold; Height: 15.8mm; Lead Free: Yes; Temperature: -40°C to +85°C; Device Class L2: Modular / Ethernet Connectors; Device Class L3: unset; Octopart: https://octopart.com/arjm11c7-502-ab-er2-t-abracon-86945316
R57-R62 = CMP-009-00206-2: READ THE NAME
R63 R64 = CMP-2000-00213-2: Chip Resistor, 120 Ohm, +/- 1%, 0.1 W, -55 to 155 degC, 0603 (1608 Metric), RoHS, Tape and Reel; Manufacturer: Panasonic; Power Rating: 100mW; Voltage Rating (DC): 75V; Resistance: 120Ohm; Temperature Coefficient: 100ppm/degreesC; Number of Terminations: 2; Military Standard: Not; Tolerance: 1%; Min Operating Temperature: -55degC; Packaging: TapeandReel; Lead Free: LeadFree; Max Operating Temperature: 155degC; Manufacturer URL: http://www.panasonic.com/; Case Code (Imperial): 0603; REACH SVHC: NoSVHC; Width: 0.031inch; Datasheet URL: https://industrial.panasonic.com/cdbs/www-data/pdf/RDA0000/AOA0000C283.pdf; RoHSCompliant: true; Max Power Dissipation: 100mW; Termination: SMD/SMT; Package Reference: 0603; Height: 0.022inch; Depth: 0.8mm; Package Description: 2-Pin Surface Mount Device, Body 1.6 x 0.85 mm; Contact Plating: Tin; Length: 1.6mm; Package URL: http://www.st.com/st-web-ui/static/active/en/resource/technical/document/datasheet/CD00001320.pdf; Radiation Hardening: No; Package Quantity: 1; Number of Pins: 2; Datasheet Version: 42095.0; Voltage Rating: 75V; Composition: ThickFilm; Case/Package: 0603; Mount: SurfaceMount; Case Code (Metric): 1608

## Sheet HDMI.SchDoc
size C; SheetNumber: 6; SheetTotal: 8
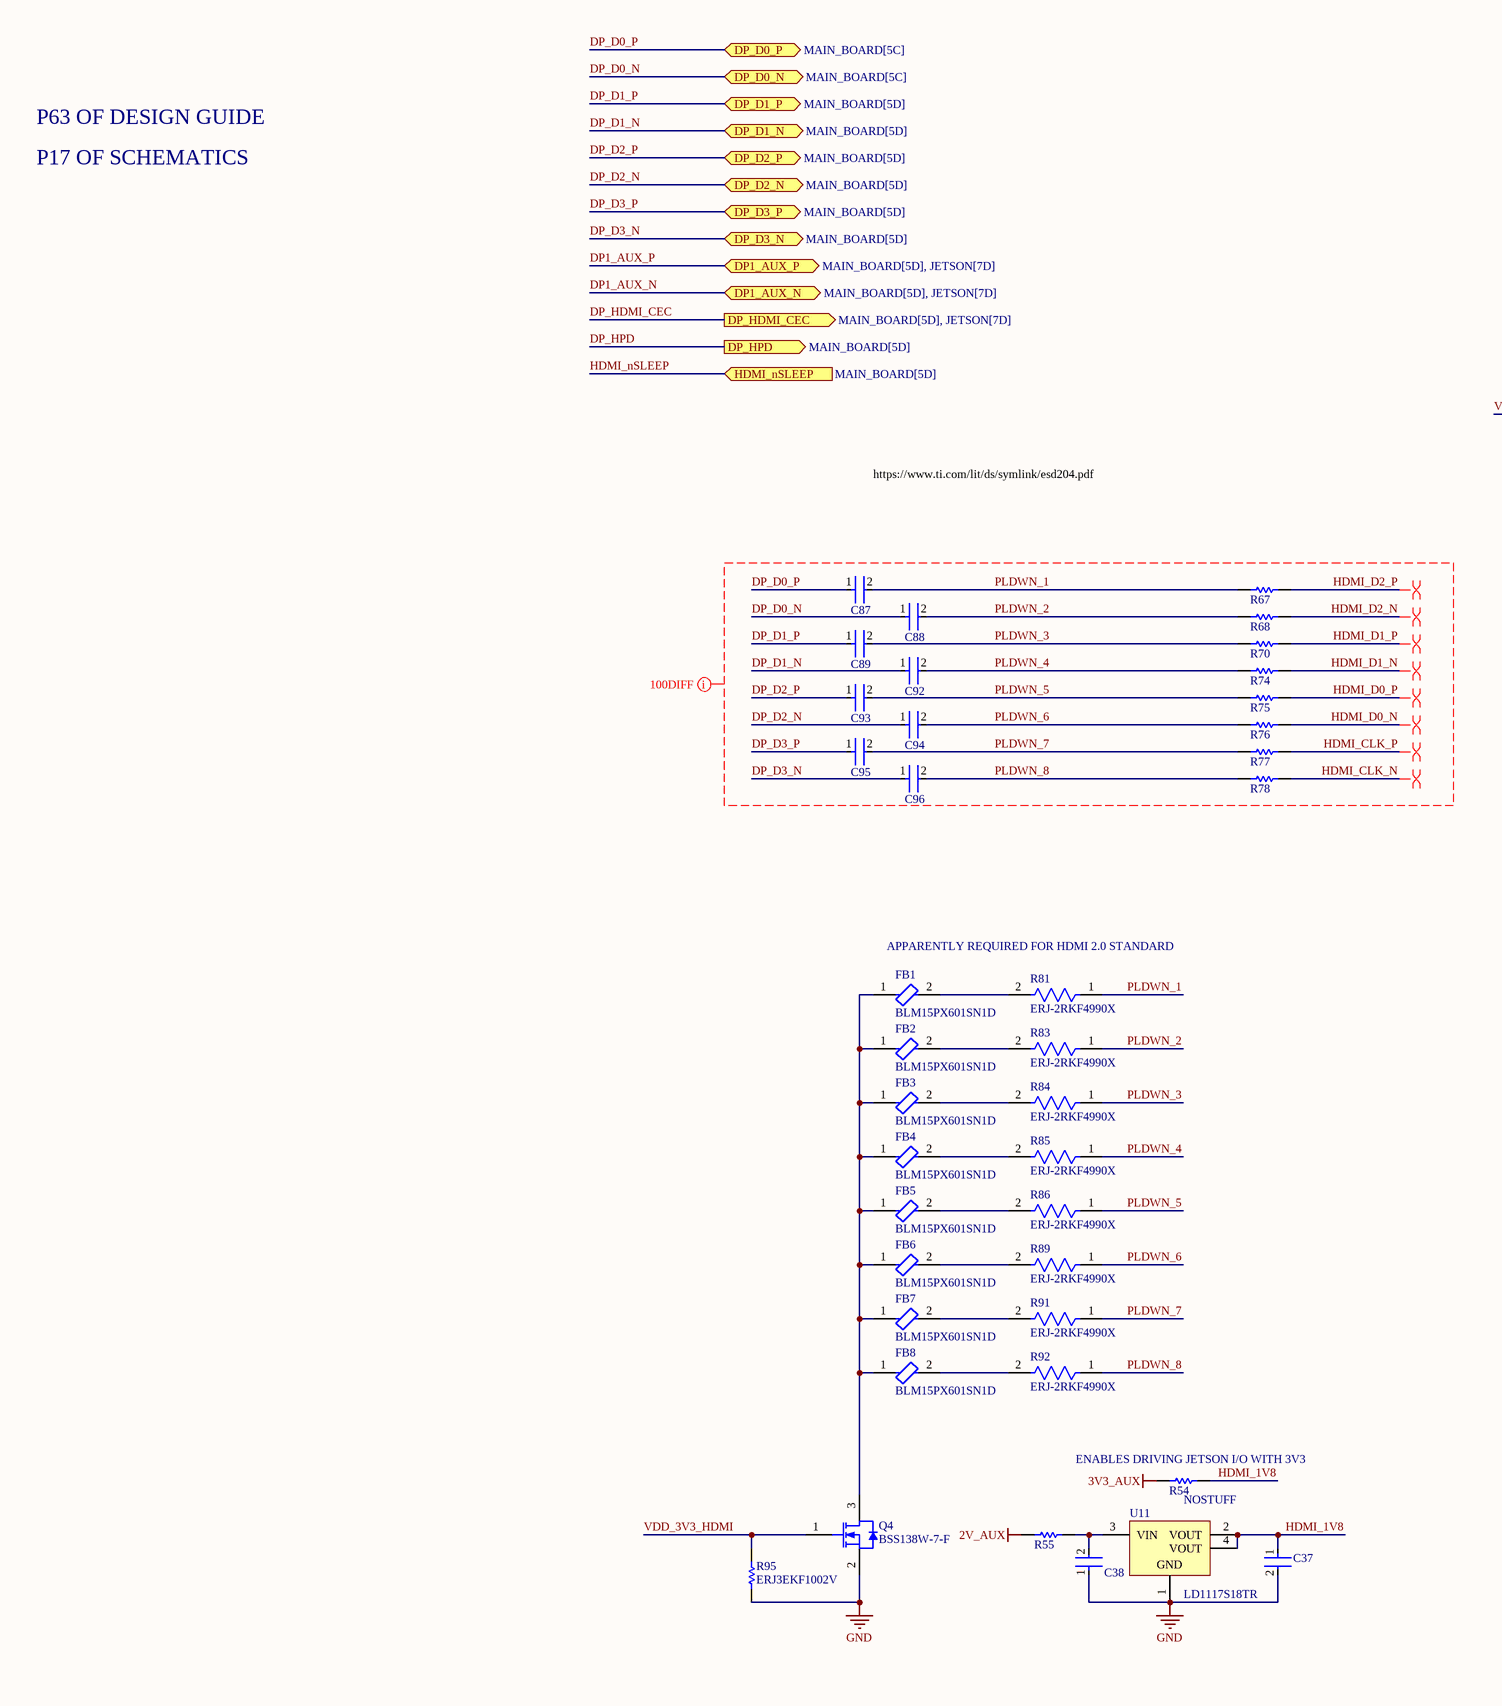
[diagram p15: HDMI.SchDoc, left]
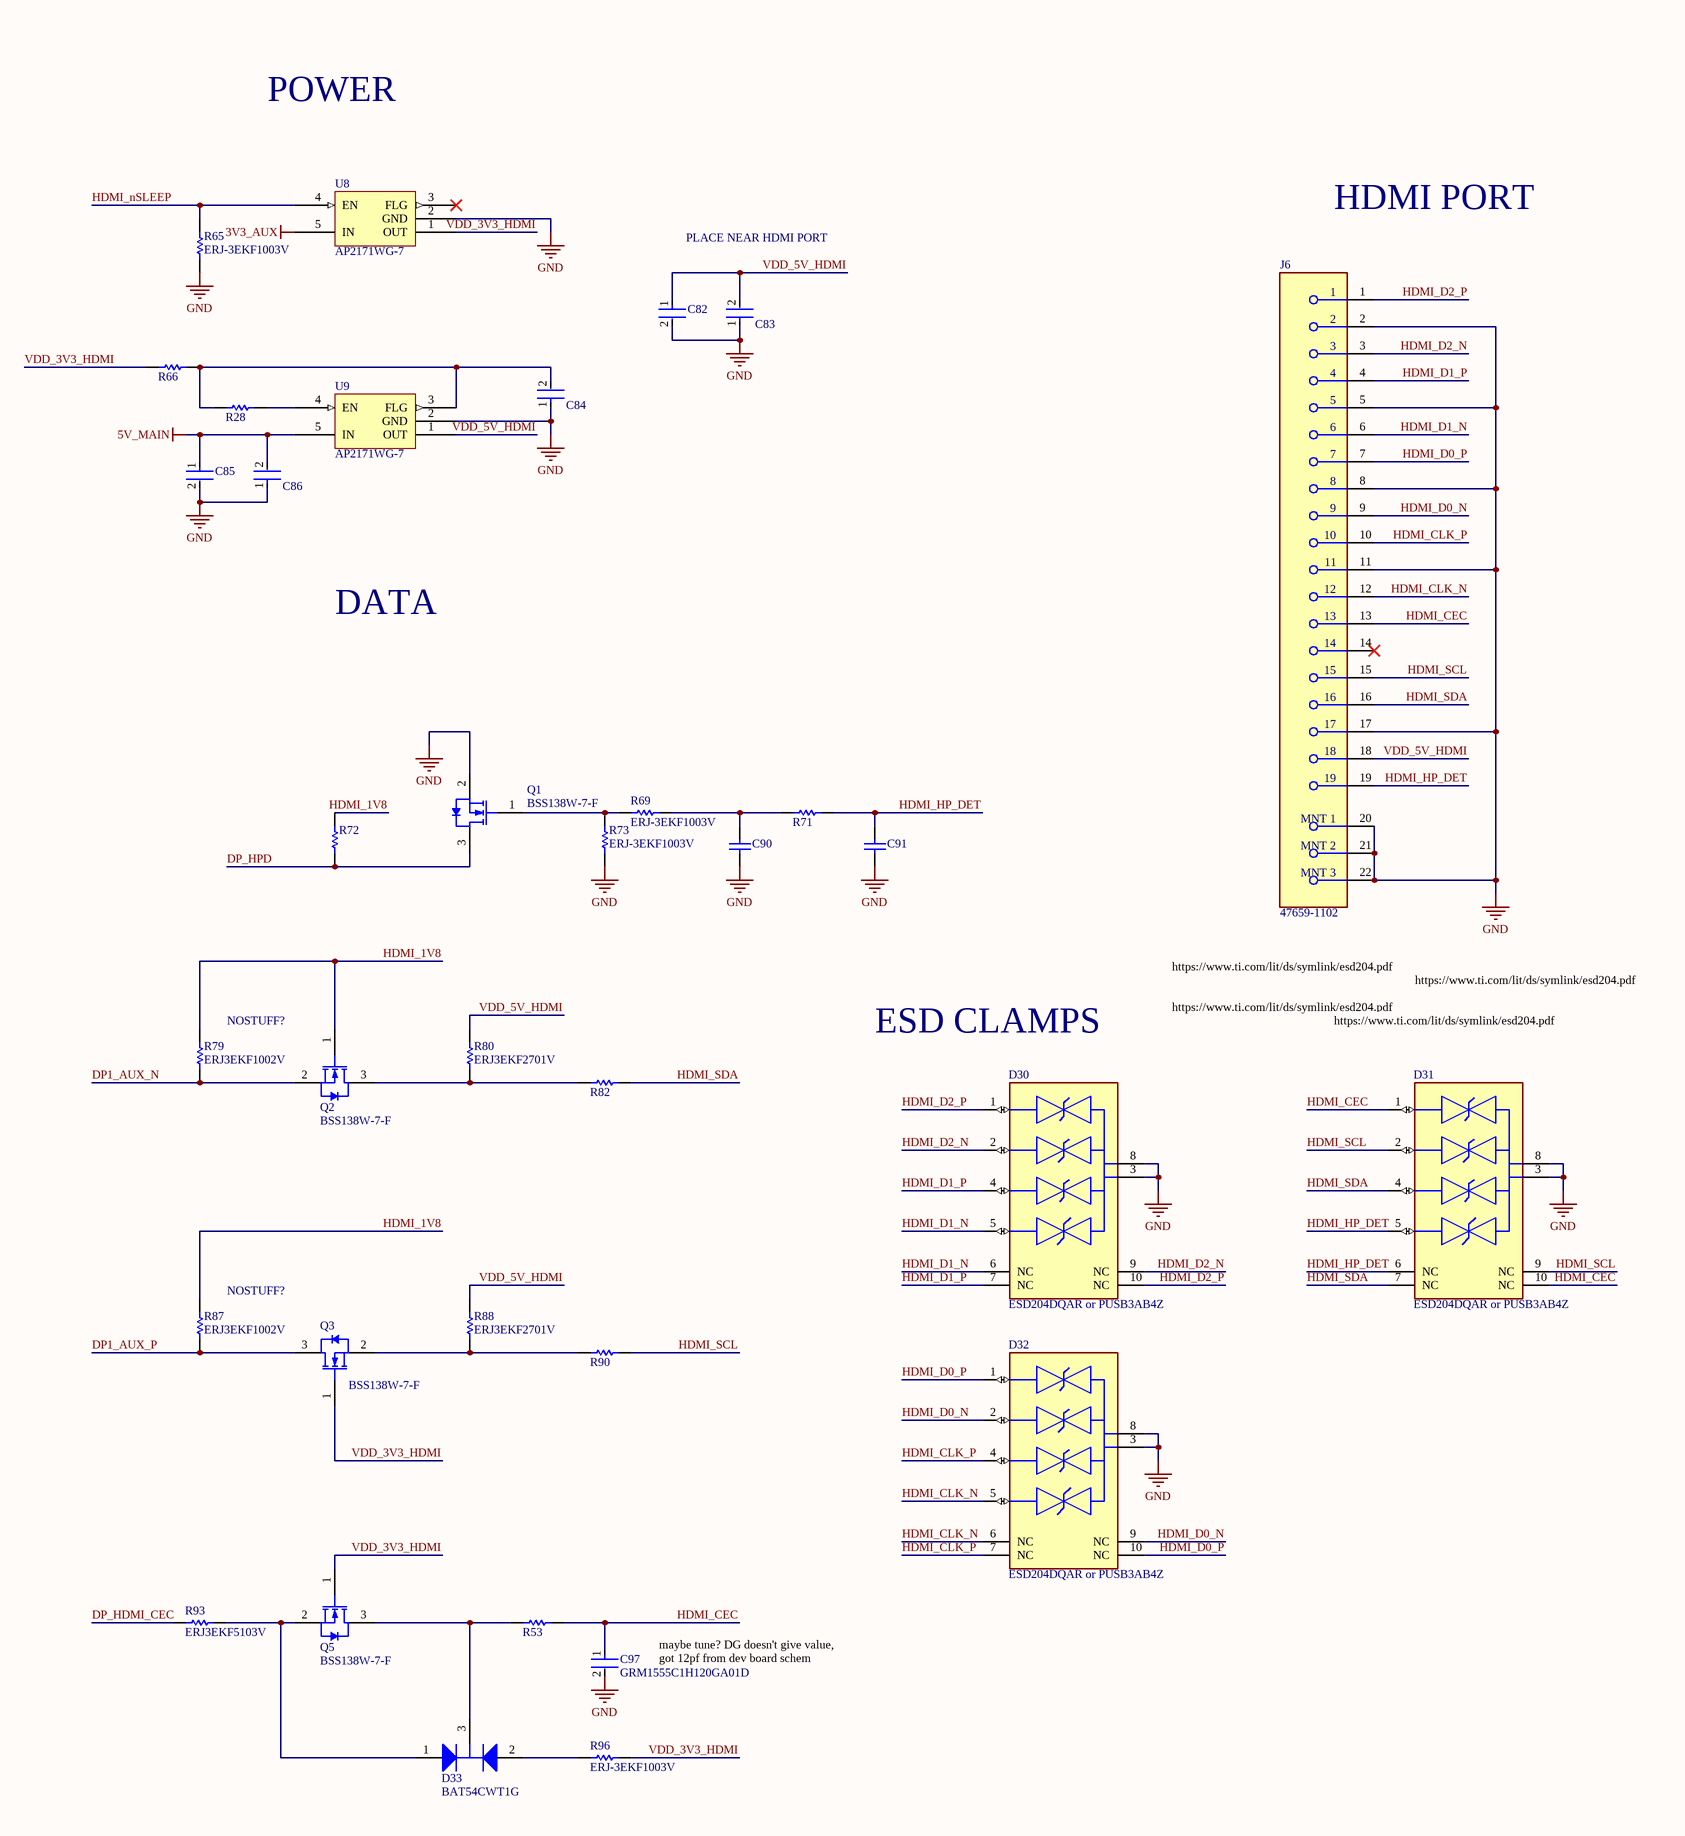
[diagram p16: HDMI.SchDoc, right]

### Parts
C37  GRM188R60J106ME47D  [FP-GRM188-0_1-e0_2_0_55-IPC_A]  (value not drawn)
C38  C1005X7R1H104K050BB  [FP-C1005-050-0_05-IPC_C]  (value not drawn)
C82  GRM188R60J106ME47D  [FP-GRM188-0_1-e0_2_0_55-IPC_A]  (value not drawn)
C83  C1005X7R1H104K050BB  [FP-C1005-050-0_05-IPC_C]  (value not drawn)
C84  C1005X7R1H104K050BB  [FP-C1005-050-0_05-IPC_C]  (value not drawn)
C85  GRM188R60J106ME47D  [FP-GRM188-0_1-e0_2_0_55-IPC_A]  (value not drawn)
C86  C1005X7R1H104K050BB  [FP-C1005-050-0_05-IPC_C]  (value not drawn)
C87  C1005X7R1H104K050BB  [FP-C1005-050-0_05-IPC_C]  (value not drawn)
C88  C1005X7R1H104K050BB  [FP-C1005-050-0_05-IPC_C]  (value not drawn)
C89  C1005X7R1H104K050BB  [FP-C1005-050-0_05-IPC_C]  (value not drawn)
C90  C0402C221K5RAC7867  [CAPC1005X60X30NL05T10]  (value not drawn)
C91  C0402C221K5RAC7867  [CAPC1005X60X30NL05T10]  (value not drawn)
C92  C1005X7R1H104K050BB  [FP-C1005-050-0_05-IPC_C]  (value not drawn)
C93  C1005X7R1H104K050BB  [FP-C1005-050-0_05-IPC_C]  (value not drawn)
C94  C1005X7R1H104K050BB  [FP-C1005-050-0_05-IPC_C]  (value not drawn)
C95  C1005X7R1H104K050BB  [FP-C1005-050-0_05-IPC_C]  (value not drawn)
C96  C1005X7R1H104K050BB  [FP-C1005-050-0_05-IPC_C]  (value not drawn)
C97  GRM1555C1H120GA01D  [FP-GRM155-0_05-MFG]
D30  ESD204DQAR or PUSB3AB4Z  [FP-DQA0010A-MFG]
D31  ESD204DQAR or PUSB3AB4Z  [FP-DQA0010A-MFG]
D32  ESD204DQAR or PUSB3AB4Z  [FP-DQA0010A-MFG]
D33  BAT54CWT1G  [ONSC-SOT-323-3-419-04_V]
FB1  BLM15PX601SN1D  [FP-BLM15-0_05-MFG]
FB2  BLM15PX601SN1D  [FP-BLM15-0_05-MFG]
FB3  BLM15PX601SN1D  [FP-BLM15-0_05-MFG]
FB4  BLM15PX601SN1D  [FP-BLM15-0_05-MFG]
FB5  BLM15PX601SN1D  [FP-BLM15-0_05-MFG]
FB6  BLM15PX601SN1D  [FP-BLM15-0_05-MFG]
FB7  BLM15PX601SN1D  [FP-BLM15-0_05-MFG]
FB8  BLM15PX601SN1D  [FP-BLM15-0_05-MFG]
J6  47659-1102  [FP-47659-1102-MFG]
Q1  BSS138W-7-F  [DIOD-SOT323-3_V]
Q2  BSS138W-7-F  [DIOD-SOT323-3_V]
Q3  BSS138W-7-F  [DIOD-SOT323-3_V]
Q4  BSS138W-7-F  [DIOD-SOT323-3_V]
Q5  BSS138W-7-F  [DIOD-SOT323-3_V]
R28  0402 JUMPER 0 OHM  [RESC1005X40X25NL05T05]  (value not drawn)
R53  0402 JUMPER 0 OHM  [RESC1005X40X25NL05T05]  (value not drawn)
R54  0402 JUMPER 0 OHM  [RESC1005X40X25NL05T05]  (value not drawn)
R55  0402 JUMPER 0 OHM  [RESC1005X40X25NL05T05]  (value not drawn)
R65  ERJ-3EKF1003V  [RESC1608X55X30ML15T15]
R66  ERJ3EKF1002V  [RESC1609X55X30LL15T15]  (value not drawn)
R67  0402 JUMPER 0 OHM  [RESC1005X40X25NL05T05]  (value not drawn)
R68  0402 JUMPER 0 OHM  [RESC1005X40X25NL05T05]  (value not drawn)
R69  ERJ-3EKF1003V  [RESC1608X55X30ML15T15]
R70  0402 JUMPER 0 OHM  [RESC1005X40X25NL05T05]  (value not drawn)
R71  0402 JUMPER 0 OHM  [RESC1005X40X25NL05T05]  (value not drawn)
R72  ERJ3EKF1002V  [RESC1609X55X30LL15T15]  (value not drawn)
R73  ERJ-3EKF1003V  [RESC1608X55X30ML15T15]
R74  0402 JUMPER 0 OHM  [RESC1005X40X25NL05T05]  (value not drawn)
R75  0402 JUMPER 0 OHM  [RESC1005X40X25NL05T05]  (value not drawn)
R76  0402 JUMPER 0 OHM  [RESC1005X40X25NL05T05]  (value not drawn)
R77  0402 JUMPER 0 OHM  [RESC1005X40X25NL05T05]  (value not drawn)
R78  0402 JUMPER 0 OHM  [RESC1005X40X25NL05T05]  (value not drawn)
R79  ERJ3EKF1002V  [RESC1609X55X30LL15T15]
R80  ERJ3EKF2701V  [RESC1608X55X30LL15T15]
R81  ERJ-2RKF4990X  [FP-ERJ2RK-MFG]
R82  0402 JUMPER 0 OHM  [RESC1005X40X25NL05T05]  (value not drawn)
R83  ERJ-2RKF4990X  [FP-ERJ2RK-MFG]
R84  ERJ-2RKF4990X  [FP-ERJ2RK-MFG]
R85  ERJ-2RKF4990X  [FP-ERJ2RK-MFG]
R86  ERJ-2RKF4990X  [FP-ERJ2RK-MFG]
R87  ERJ3EKF1002V  [RESC1609X55X30LL15T15]
R88  ERJ3EKF2701V  [RESC1608X55X30LL15T15]
R89  ERJ-2RKF4990X  [FP-ERJ2RK-MFG]
R90  0402 JUMPER 0 OHM  [RESC1005X40X25NL05T05]  (value not drawn)
R91  ERJ-2RKF4990X  [FP-ERJ2RK-MFG]
R92  ERJ-2RKF4990X  [FP-ERJ2RK-MFG]
R93  ERJ3EKF5103V  [RESC1608X55X30LL15T15]
R95  ERJ3EKF1002V  [RESC1609X55X30LL15T15]
R96  ERJ-3EKF1003V  [RESC1608X55X30ML15T15]
U8  AP2171WG-7  [SOT95P285X130-5N]
U9  AP2171WG-7  [SOT95P285X130-5N]
U11  LD1117S18TR  [SOT-223_M]

### Ports
DP1_AUX_N (bidir, see MAIN_BOARD[5D], JETSON[7D]), DP1_AUX_P (bidir, see MAIN_BOARD[5D], JETSON[7D]), DP_D0_N (bidir, see MAIN_BOARD[5C]), DP_D0_P (bidir, see MAIN_BOARD[5C]), DP_D1_N (bidir, see MAIN_BOARD[5D]), DP_D1_P (bidir, see MAIN_BOARD[5D]), DP_D2_N (bidir, see MAIN_BOARD[5D]), DP_D2_P (bidir, see MAIN_BOARD[5D]), DP_D3_N (bidir, see MAIN_BOARD[5D]), DP_D3_P (bidir, see MAIN_BOARD[5D]), DP_HDMI_CEC (out, see MAIN_BOARD[5D], JETSON[7D]), DP_HPD (out, see MAIN_BOARD[5D]), HDMI_nSLEEP (in, see MAIN_BOARD[5D])

### Nets
2V_AUX: R55.1
3V3_AUX: R54.1 U8.5(IN)
5V_MAIN: C85.1 C86.2 U9.5(IN)
GND: C37.2 C38.1 C82.2 C83.1 C84.1 C85.2 C86.1 C90.1 C91.1 C97.2 D30.3(GND) D30.8(GND) D31.3(GND) D31.8(GND) D32.3(GND) D32.8(GND) J6.2 J6.5 J6.8 J6.11 J6.17 J6.20(MNT_1) J6.21(MNT_2) J6.22(MNT_3) Q1.2(S) Q4.2(S) R65.1 R73.1 R95.1 U8.2(GND) U9.2(GND) U11.1(GND)
DP1_AUX_N: Q2.2(S) R79.1 ; port DP1_AUX_N
DP1_AUX_P: Q3.3(D) R87.1 ; port DP1_AUX_P
DP_D0_N: C88.1 ; port DP_D0_N  [project net DP1_TXD0_N]
DP_D0_P: C87.1 ; port DP_D0_P  [project net DP1_TXD0_P]
DP_D1_N: C92.1 ; port DP_D1_N  [project net DP1_TXD1_N]
DP_D1_P: C89.1 ; port DP_D1_P  [project net DP1_TXD1_P]
DP_D2_N: C94.1 ; port DP_D2_N  [project net DP1_TXD2_N]
DP_D2_P: C93.1 ; port DP_D2_P  [project net DP1_TXD2_P]
DP_D3_N: C96.1 ; port DP_D3_N  [project net DP1_TXD3_N]
DP_D3_P: C95.1 ; port DP_D3_P  [project net DP1_TXD3_P]
DP_HDMI_CEC: R93.1 ; port DP_HDMI_CEC
DP_HPD: Q1.3(D) R72.1 ; port DP_HPD  [project net DP1_HPD]
HDMI_1V8: C37.1 Q2.1(G) R54.2 R72.2 R79.2 R87.2 U11.2(VOUT) U11.4(VOUT)
HDMI_CEC: C97.1 D31.1(IO1) D31.10(NC) J6.13 R53.2
HDMI_CLK_N: D32.5(IO4) D32.6(NC) J6.12 R78.2
HDMI_CLK_P: D32.4(IO3) D32.7(NC) J6.10 R77.2
HDMI_D0_N: D32.2(IO2) D32.9(NC) J6.9 R76.2
HDMI_D0_P: D32.1(IO1) D32.10(NC) J6.7 R75.2
HDMI_D1_N: D30.5(IO4) D30.6(NC) J6.6 R74.2
HDMI_D1_P: D30.4(IO3) D30.7(NC) J6.4 R70.2
HDMI_D2_N: D30.2(IO2) D30.9(NC) J6.3 R68.2
HDMI_D2_P: D30.1(IO1) D30.10(NC) J6.1 R67.2
HDMI_HP_DET: C91.2 D31.5(IO4) D31.6(NC) J6.19 R71.2
HDMI_nSLEEP: R65.2 U8.4(EN) ; port HDMI_nSLEEP
HDMI_SCL: D31.2(IO2) D31.9(NC) J6.15 R90.2
HDMI_SDA: D31.4(IO3) D31.7(NC) J6.16 R82.2
PLDWN_1: C87.2 R67.1 R81.1
PLDWN_2: C88.2 R68.1 R83.1
PLDWN_3: C89.2 R70.1 R84.1
PLDWN_4: C92.2 R74.1 R85.1
PLDWN_5: C93.2 R75.1 R86.1
PLDWN_6: C94.2 R76.1 R89.1
PLDWN_7: C95.2 R77.1 R91.1
PLDWN_8: C96.2 R78.1 R92.1
VDD_3V3_HDMI: Q3.1(G) Q4.1(G) Q5.1(G) R66.2 R95.2 R96.2 U8.1(OUT)
VDD_5V_HDMI: C82.1 C83.2 J6.18 R80.2 R88.2 U9.1(OUT)
NetC38_2: C38.2 R55.2 U11.3(VIN)
NetC84_2: C84.2 R28.1 R66.1 U9.3(FLG)
NetC90_2: C90.2 R69.2 R71.1
NetD33_1: D33.1(A1) Q5.2(S) R93.2
NetD33_2: D33.2(A2) R96.1
NetD33_3: D33.3(K) Q5.3(D) R53.1
NetFB1_1: FB1.1 FB2.1 FB3.1 FB4.1 FB5.1 FB6.1 FB7.1 FB8.1 Q4.3(D)
NetFB1_2: FB1.2 R81.2
NetFB2_2: FB2.2 R83.2
NetFB3_2: FB3.2 R84.2
NetFB4_2: FB4.2 R85.2
NetFB5_2: FB5.2 R86.2
NetFB6_2: FB6.2 R89.2
NetFB7_2: FB7.2 R91.2
NetFB8_2: FB8.2 R92.2
NetQ1_1: Q1.1(G) R69.1 R73.2
NetQ2_3: Q2.3(D) R80.1 R82.1
NetQ3_2: Q3.2(S) R88.1 R90.1
NetR28_2: R28.2 U9.4(EN)

Not connected (* = marked no-connect by the designer): J6 14*; U8 3(FLG)*

### Layout directives
differential pair: HDMI_CLK_N, HDMI_CLK_P, HDMI_D0_N, HDMI_D0_P, HDMI_D1_N, HDMI_D1_P, HDMI_D2_N, HDMI_D2_P
net class 100DIFF: DP_D0_N, DP_D0_P, DP_D1_N, DP_D1_P, DP_D2_N, DP_D2_P, DP_D3_N, DP_D3_P, HDMI_CLK_N, HDMI_CLK_P, HDMI_D0_N, HDMI_D0_P, HDMI_D1_N, HDMI_D1_P, HDMI_D2_N, HDMI_D2_P, PLDWN_1, PLDWN_2, PLDWN_3, PLDWN_4, PLDWN_5, PLDWN_6, PLDWN_7, PLDWN_8

### Notes on the sheet
- P63 OF DESIGN GUIDE
- P17 OF SCHEMATICS
- POWER
- HDMI PORT
- PLACE NEAR HDMI PORT
- https://www.ti.com/lit/ds/symlink/esd204.pdf
- DATA
- APPARENTLY REQUIRED FOR HDMI 2.0 STANDARD
- (near R79) NOSTUFF?
- ESD CLAMPS
- (near R87) NOSTUFF?
- (near R54) ENABLES DRIVING JETSON I/O WITH 3V3
- (near R54) NOSTUFF
- maybe tune? DG doesn't give value, got 12pf from dev board schem

### Library data of the parts
C37 C82 C85 = CMP-2006-02792-2: Chip Multilayer Ceramic Capacitors for General Purpose, 0603, 10uF, X5R, 15%, 20%, 6.3V; Packaging: Tape and Reel; Voltage Rating (DC): 6.3V; Width: 0.031inch; Termination: SMD/SMT; Dielectric: X5R; Package Quantity: 4000; Voltage Rating: 6.3V; Capacitance: 10uF; Case/Package: 0603; Min Operating Temperature: -55°C; Voltage: 6.3V; Length: 1.6mm; Thickness: 0.035inch; Lead Free: Lead Free; Depth: 0.8mm; Case Code (Imperial): 0603; Max Operating Temperature: 85°C; Material: Ceramic; Height: 0.8mm; Tolerance: 20%; Mount: Surface Mount; REACH SVHC: No SVHC; Radiation Hardening: No; Case Code (Metric): 1608
C38 C83 C84 C86-C89 C92-C96 = CMP-2000-05393-2: Multilayer Ceramic Capacitors 100nF ±10% 50V X7R SMD 0402; Voltage: 50V; Dielectric Material: Ceramic; Min Operating Temperature: -55°C; Depth: 0.5mm; Radiation Hardening: No; RoHS Compliant: Yes; Voltage Rating (DC): 50V; Lead Free: Lead Free; Resistor Type: Ceramic; Height: 0.5mm; Dielectric: X7R; Thickness: 0.022inch; Case/Package: 0402; Case Code (Metric): 1005; Termination: SMD/SMT; Capacitance: 100nF; Packaging: Tape and Reel; Max Operating Temperature: 125°C; Mount: Surface Mount; Package Quantity: 1; Width: 0.02inch; Weight: 2.3E-05oz; Voltage Rating: 50V; Tolerance: 10%; Construction: Flat; Case Code (Imperial): 0402; Length: 1mm; REACH SVHC: No SVHC; Series: C
C90 C91 = CMP-2008-03137-2: Manufacturer: Kemet; Part Number: C0402C221K5RAC7867
C97 = CMP-2008-03945-2: CAP CER 12PF 50V C0G/NP0 0402; Tolerance: 2%; Dielectric: C0G; Material: Ceramic; Termination: SMD/SMT; Mount: Surface Mount; REACH SVHC: No SVHC; Depth: 0.5mm; Case Code (Metric): 1005; Voltage Rating: 50V; Height: 0.5mm; Voltage Rating (DC): 50V; Case Code (Imperial): 0402; Package Quantity: 10000; Construction: Flat; Thickness: 0.022inch; Length: 1mm; Min Operating Temperature: -55°C; Width: 0.5mm; Lead Free: Lead Free; Capacitance: 12pF; Case/Package: 0402; Packaging: Tape and Reel; Series: GRM; Voltage: 50V; Radiation Hardening: No; Max Operating Temperature: 125°C
D30-D32 = CMP-04989-000002-1: 4-CHANNEL LOW-CAPACITANCE SURGE; Manufacturer: Texas Instruments; Value: 0.55pF; Reverse Standoff Voltage: 3.6V; Standoff Height: 0mm; Breakdown Voltage: 5.5V; Peak Pulse Current: 5.5A; Clamping Voltage: 11.5V; Direction: Bidirectional; Peak Pulse Power: 50W; Number Of Channels: 4; Ambient Temperature Range High: +125°C; ComponentLink2Description: Datasheet; Height: 0.55mm; Lead Free: Yes; Device Class L3: unset; Temperature Range High: +125°C; Temperature Range Low: -40°C; Package: DQA0010A; Temperature: -40°C to +125°C; Capacitance: 0.55pF; RoHS: TRUE; Mouser Description: 4-Channel Low-Capacitance Surge and ESD Protection Diode 10-USON -40 to 125; Category: Diode; Device Class L1: Circuit Protection; Octopart: https://octopart.com/esd204dqar-texas+instruments-89917476; Device Class L2: TVS Diodes; Ambient Temperature Range Low: -40°C; Manufacturer Part Number: ESD204DQAR; ComponentLink2URL: http://www.ti.com/lit/ds/symlink/esd204.pdf; Automotive: No; Digikey Description: 4-CHANNEL LOW-CAPACITANCE SURGE
D33 = CMP-1055-00557-1: Dual Series Cathode Schottky Barrier Diodes, 3-Pin SOT-323, Pb-Free, Tape and Reel; Manufacturer: On Semiconductor; Configuration: Common Cathode; IFSM Max (A): 0.6; trr Max (ns): 5; ComponentLink2Description: Datasheet; Packing: Tape and Reel; ComponentLink3Description: Package Specification; Mounting Technology: Surface Mount; PartNumber: BAT54CWT1G; PackageVersion: Rev. N, 11/2008; RoHS: TRUE; ComponentLink3URL: http://www.onsemi.com/pub_link/Collateral/419-04.PDF; ComponentLink2URL: http://www.onsemi.cn/pub_link/Collateral/BAT54CWT1-D.PDF; PackageReference: SOT-323-3-419-04; ComponentLink1URL: http://www.onsemi.com/; ComponentLink1Description: Manufacturer URL; DatasheetVersion: Rev. 7; PackageDescription: 3-Pin Small Outline Transistor, Body 2 x 1.25 mm, Pitch 0.65 mm
FB1-FB8 = CMP-0686-00252-4: Chip Ferrite Bead, 0402, 600Ω @ 100MHz, 0.23Ω, 25%, 900mA; Number of Circuits: 1; Impedance: 600R; DC Resistance (DCR): 230mR; Material: Steel; Length: 1mm; Package Quantity: 10000; Height: 0.5mm; Width: 0.5mm; Max DC Current: 900mA; Number of Lines: 1; Termination: SMD/SMT; Packaging: Tape and Reel; Lead Free: Lead Free; Min Operating Temperature: -55°C; Max Operating Temperature: 125°C; Max Current Rating: 900mA; Case Code (Imperial): 0402; Number of Pins: 2; Current Rating: 900mA; Test Frequency: 100MHz; Case/Package: 0402; Tolerance: 25%; Case Code (Metric): 1005
J6 = CMP-04768-000010-1: HDMI REC.VERTICAL SMT TYPE W/HEI; RoHS Compliant: Yes
Q1-Q5 = CMP-2000-05968-1: N-Channel Enhancement Mode Mosfet, 50 V, 200 mA, -55 to 150 degC, 6-Pin SOT-323, RoHS, Tape and Reel; Typical Turn-Off Delay Time: 20ns; Number of Channels: 1Channel; Type: EnhancementModeFieldEffectTransistor; Brand: DiodesIncorporated; Vds - Drain-Source Breakdown Voltage: 75V; Vgs - Gate-Source Voltage: 20V; Rds On - Drain-Source Resistance: 1.4Ohms; Transistor Type: 1N-Channel; Configuration: Single; Unit Weight: 0.000212oz; Pd - Power Dissipation: 200mW; Id - Continuous Drain Current: 200mA; Forward Transconductance - Min: 0.1S; Manufacturer URL: http://www.diodes.com/; Series: BSS138; Package Description: 3-Pin Small Outline Transistor, Body 2 x 1.25 mm, Pitch 0.65 mm; Mounting Technology: SurfaceMount; Product Category: MOSFET; RoHS: True; Maximum Operating Temperature: +150C; Height: 1mm; Length: 2.2mm; Technology: Si; Width: 1.35mm; Datasheet URL: http://www.diodes.com/_files/datasheets/ds30206.pdf; Manufacturer: DiodesIncorporated; Package / Case: SOT-323-3; Typical Turn-On Delay Time: 20ns; Transistor Polarity: N-Channel; Factory Pack Quantity: 3000; Packaging: Reel; Product: MOSFETSmallSignal; Datasheet Version: Rev. 11-2, 09/2013; Package Reference: SOT323; Minimum Operating Temperature: -55C; Mounting Style: SMD/SMT; Channel Mode: Enhancement
R28 R53-R55 R67 R68 R70 R71 R74-R78 R82 R90 = CMP-009-00206-2: READ THE NAME
R65 R69 R73 R96 = CMP-2000-00182-1: Manufacturer: Panasonic; Part Number: ERJ-3EKF1003V
R66 R72 R79 R87 R95 = CMP-1012-00623-3: Chip Resistor, 10 KOhm, +/- 1%, 0.1 W, -55 to 155 degC, 0603 (1608 Metric), RoHS, Tape and Reel; Manufacturer: Panasonic; Voltage Rating: 75V; Case\/Package: 0603; Power Rating: 100mW; Resistance: 10KOhm; Temperature Coefficient: 100ppm\/degreesC; Number of Pins: 2; Package Reference: 603; Depth: 0.8mm; Mount: SurfaceMount; Package Description: 2-Pin Surface Mount Device, Body 1.6 x 0.85 mm; Datasheet Version: 02/2017; Length: 1.6mm; Lead Free: LeadFree; Height: 0.45mm; Number of Terminations: 2; Max Power Dissipation: 100mW; Min Operating Temperature: -55degC; Datasheet URL: https://industrial.panasonic.com/cdbs/www-data/pdf/RDA0000/AOA0000C304.pdf; Termination: SMD/SMT; Case Code (Metric): 1608; Case Code (Imperial): 0603; Tolerance: 1%; Max Operating Temperature: 155degC; RoHSCompliant: true; Voltage Rating (DC): 75V; Radiation Hardening: No; Packaging: TapeandReel; Composition: ThickFilm; Mounting Technology: SurfaceMount; Manufacturer URL: http://www.panasonic.com/; Width: 0.031inch; REACH SVHC: NoSVHC; Contact Plating: Tin; Military Standard: Not; Package Quantity: 1
R80 R88 = CMP-2000-00389-1: Manufacturer: Panasonic; Part Number: ERJ3EKF2701V
R81 R83-R86 R89 R91 R92 = CMP-2002-00965-2: RES SMD 499 OHM 1% 1/10W 0402; Temperature Coefficient: 100ppm/°C; Max Power Dissipation: 100mW; Voltage Rating (DC): 50V; Resistance: 499R; Technology: THICK FILM; Min Operating Temperature: -55°C; Package Quantity: 1; Width: 0.02inch; Contact Plating: Tin; Tolerance: 1%; Features: Automotive AEC-Q200; Resistance Tolerance: 1%; Size Code: 0402; Military Standard: Not; Resistor Type: Thick Film; Case/Package: 0402; Mount: Surface Mount; Case Code (Metric): 1005; RoHS Compliant: Yes; REACH SVHC: No SVHC; Number of Terminations: 2; Construction: Rectangular; Packaging: Tape and Reel; Series: ERJ; Lead Free: Lead Free; Length: 1mm; Voltage Rating: 50V; Termination: SMD/SMT; Max Operating Temperature: 155°C; Case Code (Imperial): 0402; Height: 0.35mm; Power Rating: 100mW; Depth: 0.5mm
R93 = CMP-2000-00542-1: Manufacturer: Panasonic; Part Number: ERJ3EKF5103V
U8 U9 = CMP-019-00057-1: IC PWR SW USB 1CH 1A SOT-25-5
U11 = CMP-0244-00308-1: Fixed Low Drop Positive Voltage Regulator, 1.8V, 4-Pin SOT-223, Tape and Reel; ComponentLink1URL: http://www.st.com; PackageReference: SOT-223; PackageDescription: 4-Pin SOT-223 Package, 6.5 x 3.5 mm Body, 2.3 mm Pitch, 7 mm Lead Span; ComponentLink2URL: http://www.st.com/internet/com/TECHNICAL_RESOURCES/TECHNICAL_LITERATURE/DATASHEET/CD00000544.pdf; ComponentLink2Description: Datasheet; ComponentLink1Description: Manufacturer URL; DatasheetVersion: 1/11/2011; PackageVersion: 2010